# EAGLE design dzik0 (EAGLE 8.4.1)
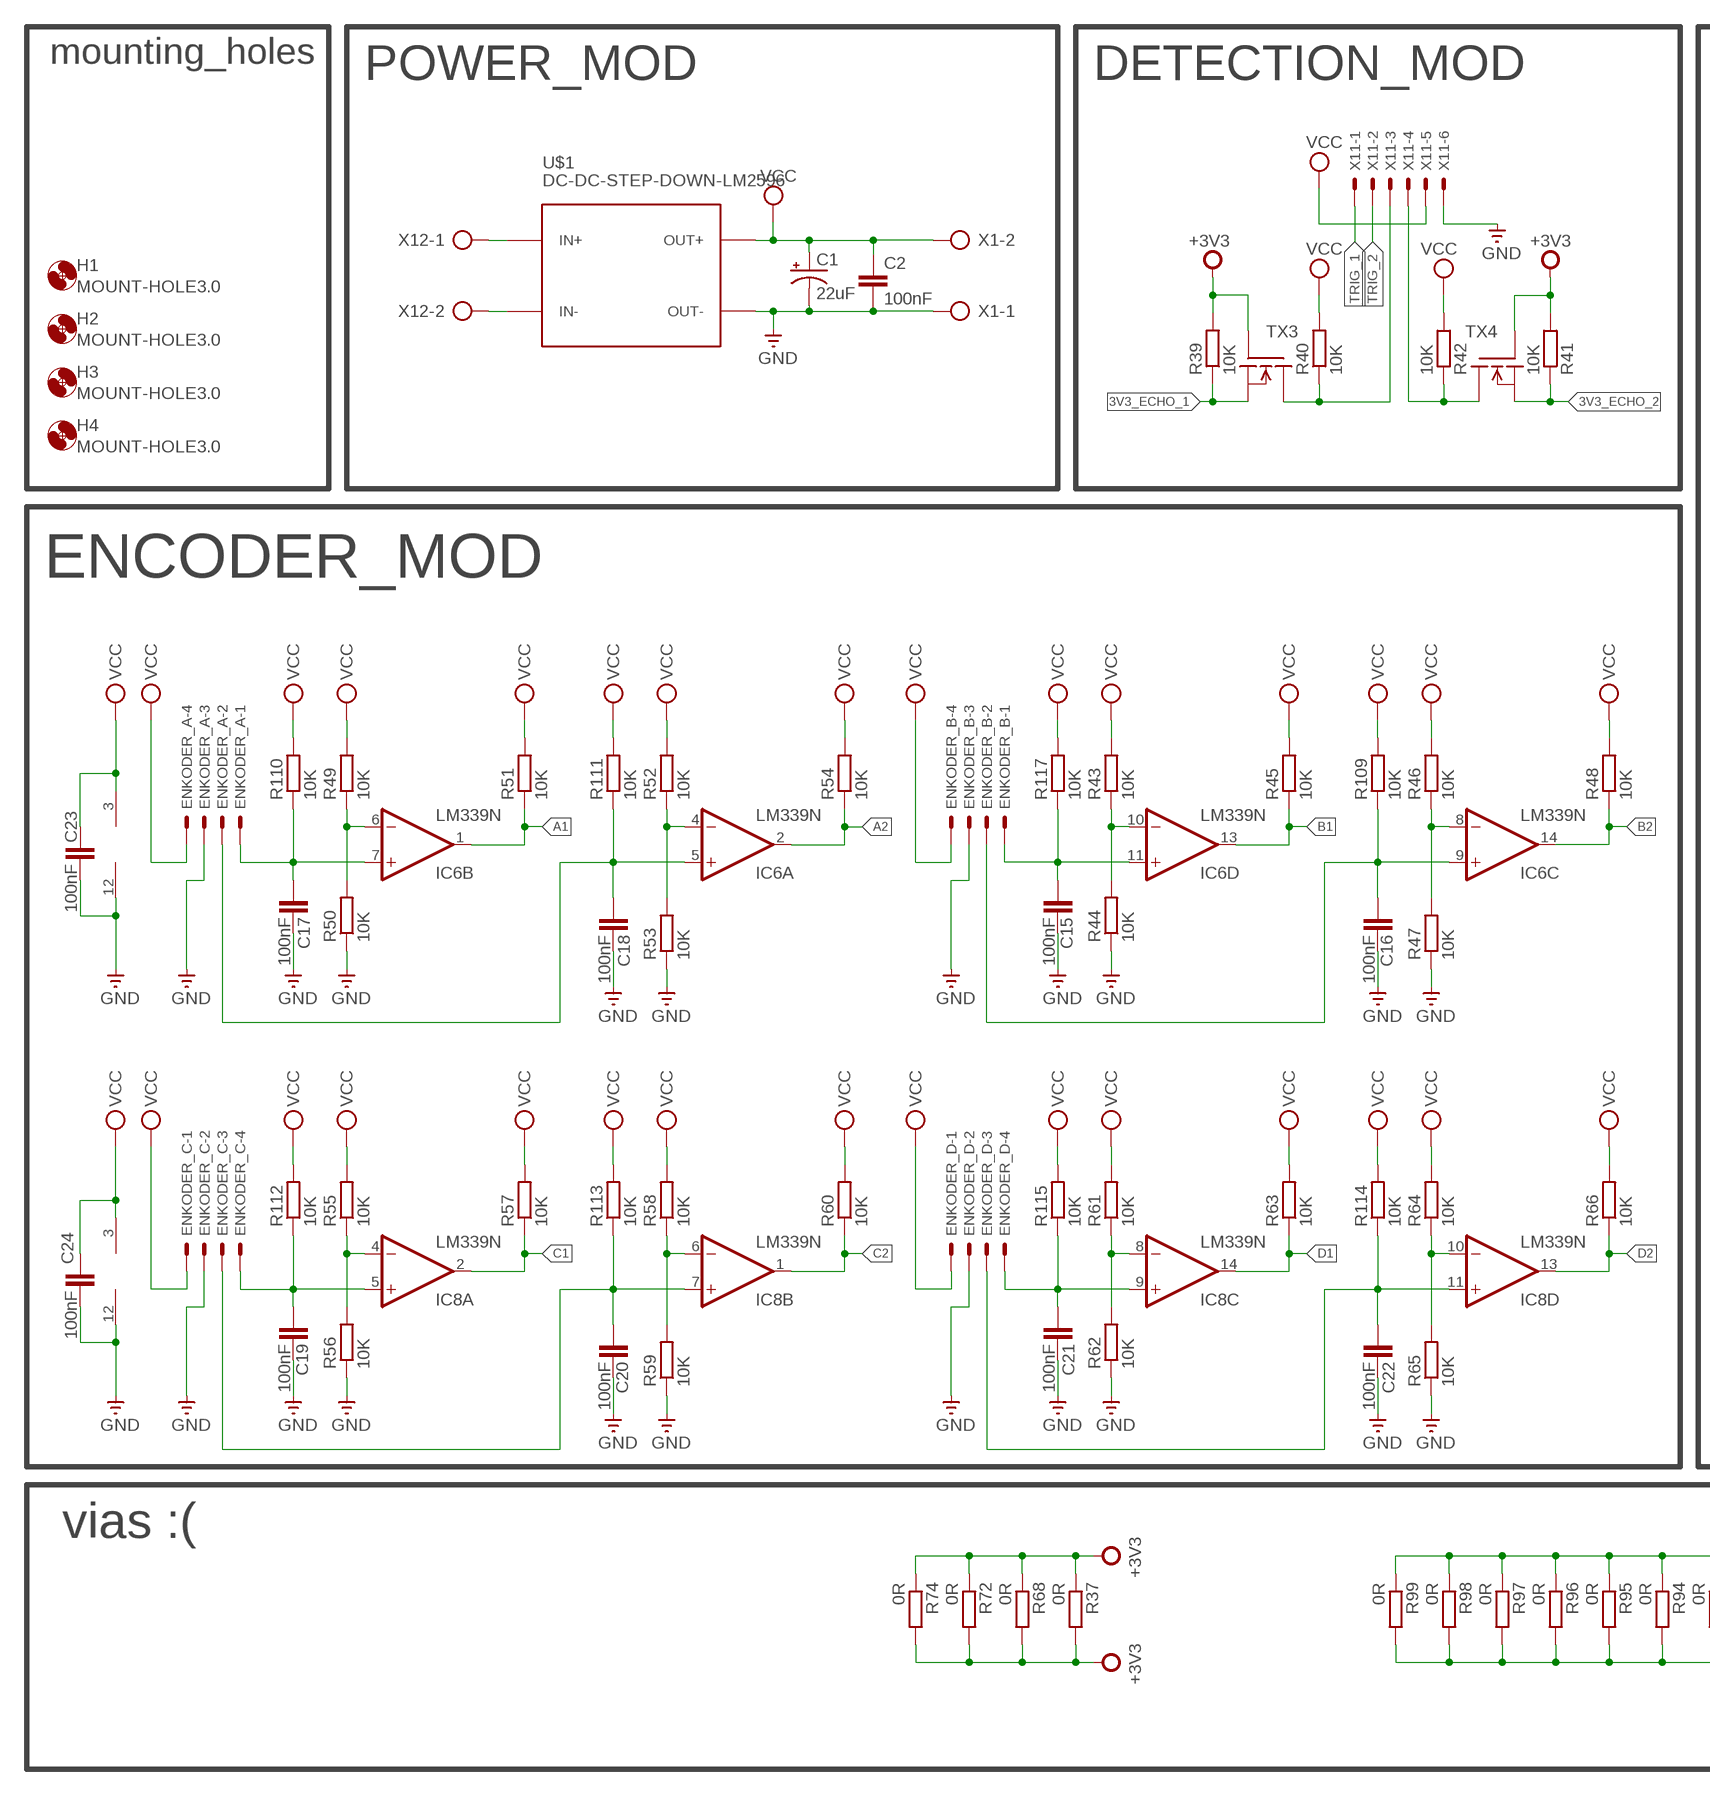
[diagram p0: schematic, sheet 1, part 1 of 2]
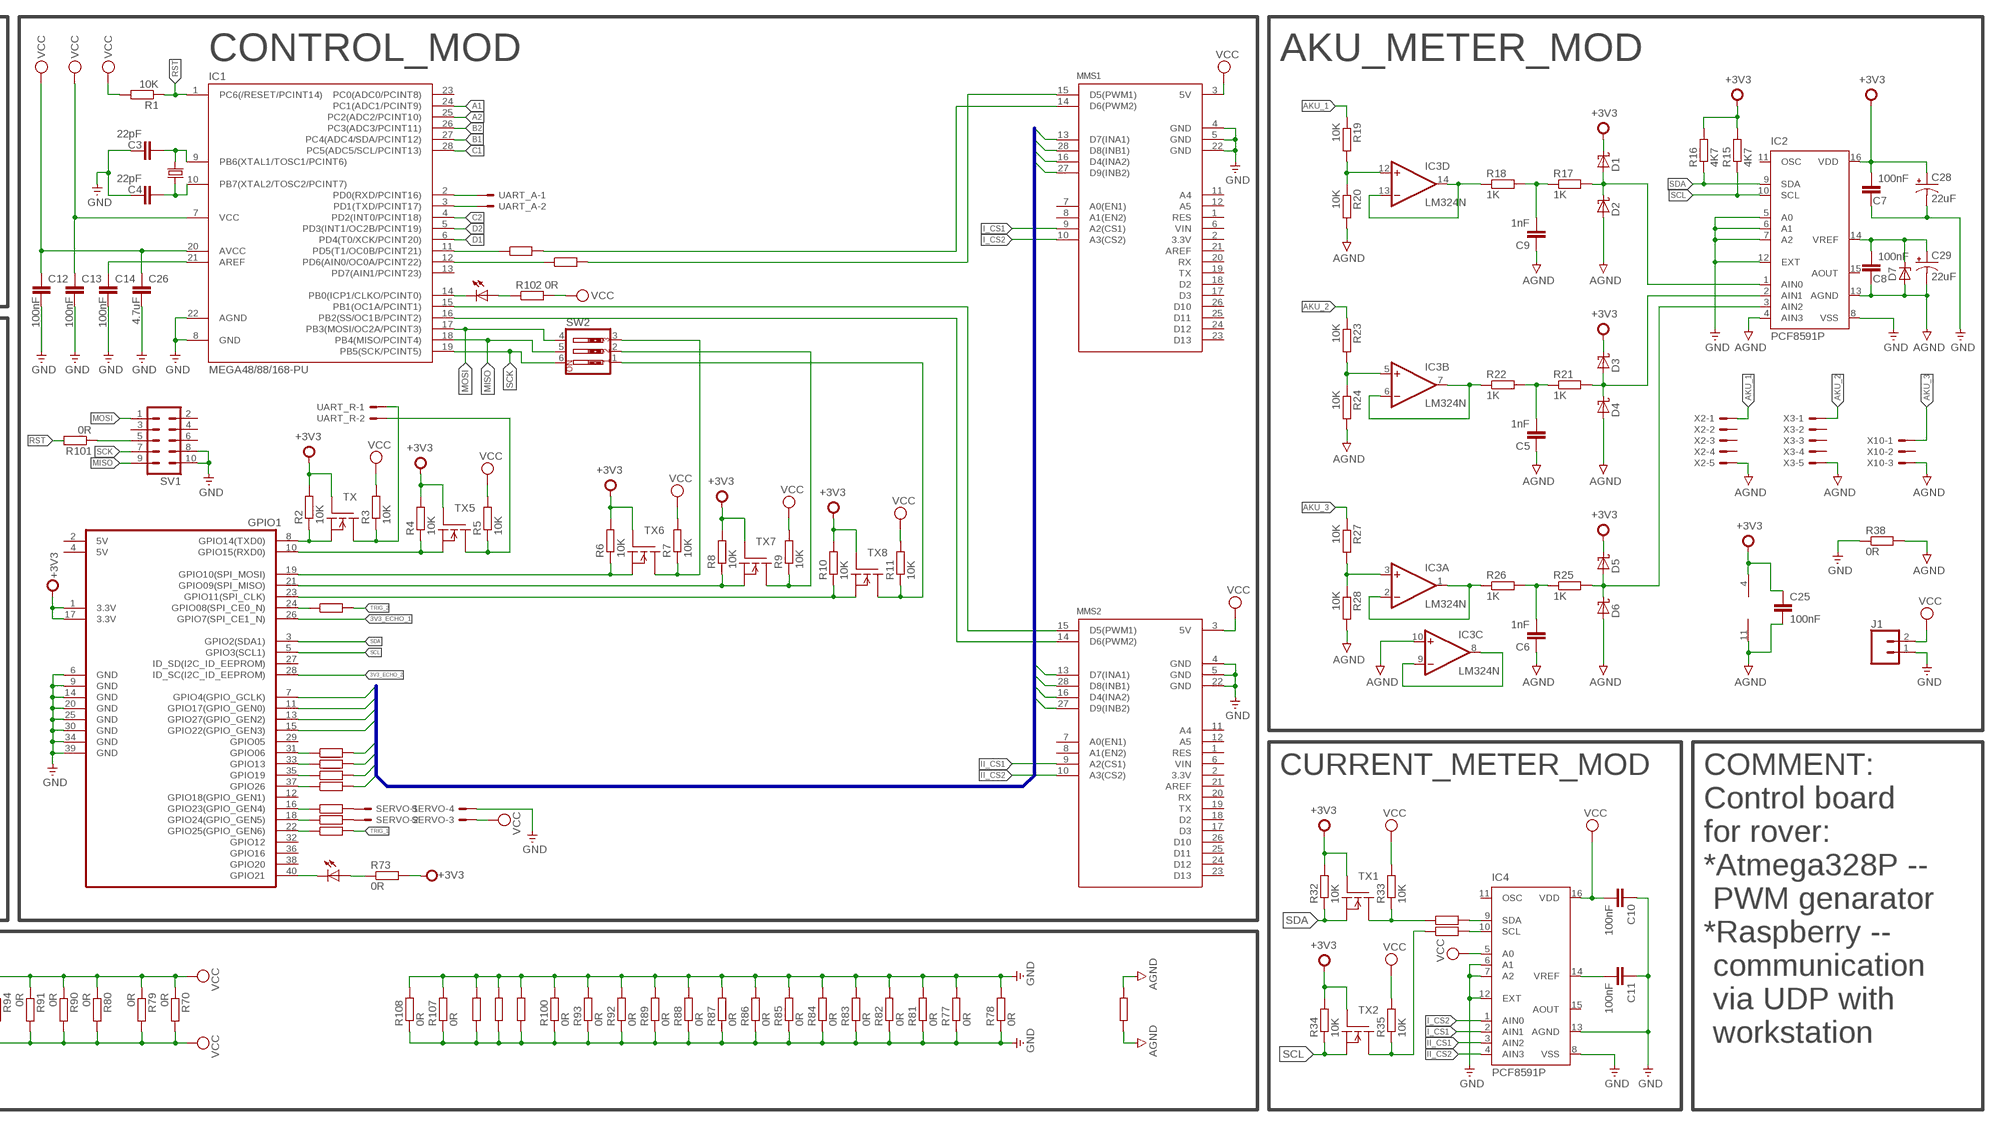
[diagram p1: schematic, sheet 1, part 2 of 2]

## Parts
C1  22uF  CPOL-USE2.5-6  [E2,5-6]
C2  100nF  C-EU025-024X044  [C025-024X044]
C3  22pF  C-EU025-024X044  [C025-024X044]
C4  22pF  C-EU025-024X044  [C025-024X044]
C5  1nF  C-EU025-024X044  [C025-024X044]
C6  1nF  C-EU025-024X044  [C025-024X044]
C7  100nF  C-EU025-024X044  [C025-024X044]
C8  100nF  C-EU025-024X044  [C025-024X044]
C9  1nF  C-EU025-024X044  [C025-024X044]
C10  100nF  C-EU025-024X044  [C025-024X044]
C11  100nF  C-EU025-024X044  [C025-024X044]
C12  100nF  C-EU025-024X044  [C025-024X044]
C13  100nF  C-EU025-024X044  [C025-024X044]
C14  100nF  C-EU025-024X044  [C025-024X044]
C15  100nF  C-EU025-024X044  [C025-024X044]
C16  100nF  C-EU025-024X044  [C025-024X044]
C17  100nF  C-EU025-024X044  [C025-024X044]
C18  100nF  C-EU025-024X044  [C025-024X044]
C19  100nF  C-EU025-024X044  [C025-024X044]
C20  100nF  C-EU025-024X044  [C025-024X044]
C21  100nF  C-EU025-024X044  [C025-024X044]
C22  100nF  C-EU025-024X044  [C025-024X044]
C23  100nF  C-EU025-024X044  [C025-024X044]
C24  100nF  C-EU025-024X044  [C025-024X044]
C25  100nF  C-EU025-024X044  [C025-024X044]
C26  4.7uF  C-EU050-025X075  [C050-025X075]
C28  22uF  CPOL-USE2.5-6  [E2,5-6]
C29  22uF  CPOL-USE2.5-6  [E2,5-6]
D1  SCHOTTKY-DIODEDO35-7  [DO35-7]
D2  SCHOTTKY-DIODEDO35-7  [DO35-7]
D3  SCHOTTKY-DIODEDO35-7  [DO35-7]
D4  SCHOTTKY-DIODEDO35-7  [DO35-7]
D5  SCHOTTKY-DIODEDO35-7  [DO35-7]
D6  SCHOTTKY-DIODEDO35-7  [DO35-7]
D7  ZENER-DIODEZD-5  [ZDIO-5]
ENKODER_A  JST-XH-04-PIN-LONG-PAD  [JST-XH-04-PACKAGE-LONG-PAD]
ENKODER_B  JST-XH-04-PIN-LONG-PAD  [JST-XH-04-PACKAGE-LONG-PAD]
ENKODER_C  JST-XH-04-PIN-LONG-PAD  [JST-XH-04-PACKAGE-LONG-PAD]
ENKODER_D  JST-XH-04-PIN-LONG-PAD  [JST-XH-04-PACKAGE-LONG-PAD]
GPIO1  _GPIO_RASPBERRY  [GPIO_RASPBERRY]
H1  MOUNT-HOLE3.0  [3,0]
H2  MOUNT-HOLE3.0  [3,0]
H3  MOUNT-HOLE3.0  [3,0]
H4  MOUNT-HOLE3.0  [3,0]
IC1  MEGA48/88/168-PU  [DIL28-3]
IC2  PCF8591P  [DIL16]
IC3  LM324N  [DIL14]
IC4  PCF8591P  [DIL16]
IC6  LM339N  [DIL14]
IC8  LM339N  [DIL14]
J1  CONN_02  [1X02]
LED1  LED5MM  [LED5MM]
LED3  LED5MM  [LED5MM]
MMS1  MONSTERMOTO_SHIELD  [MONSTER_MOTO_1]
MMS2  MONSTERMOTO_SHIELD  [MONSTER_MOTO_1]
Q1  11.520MHz  CRYSTALHC49S  [HC49/S]
R1  10K  R-EU_0207/7  [0207/7]
R2  10K  R-EU_0207/7  [0207/7]
R3  10K  R-EU_0207/7  [0207/7]
R4  10K  R-EU_0207/7  [0207/7]
R5  10K  R-EU_0207/7  [0207/7]
R6  10K  R-EU_0207/7  [0207/7]
R7  10K  R-EU_0207/7  [0207/7]
R8  10K  R-EU_0207/7  [0207/7]
R9  10K  R-EU_0207/7  [0207/7]
R10  10K  R-EU_0207/7  [0207/7]
R11  10K  R-EU_0207/7  [0207/7]
R12  0R  R-EU_0207/10  [0207/10]
R13  0R  R-EU_0207/10  [0207/10]
R14  0R  R-EU_0207/10  [0207/10]
R15  4K7  R-EU_0207/7  [0207/7]
R16  4K7  R-EU_0207/7  [0207/7]
R17  1K  R-EU_0207/7  [0207/7]
R18  1K  R-EU_0207/7  [0207/7]
R19  10K  R-EU_0207/7  [0207/7]
R20  10K  R-EU_0207/7  [0207/7]
R21  1K  R-EU_0207/7  [0207/7]
R22  1K  R-EU_0207/7  [0207/7]
R23  10K  R-EU_0207/7  [0207/7]
R24  10K  R-EU_0207/7  [0207/7]
R25  1K  R-EU_0207/7  [0207/7]
R26  1K  R-EU_0207/7  [0207/7]
R27  10K  R-EU_0207/7  [0207/7]
R28  10K  R-EU_0207/7  [0207/7]
R29  0R  R-EU_0204/7  [0204/7]
R30  0R  R-EU_0204/7  [0204/7]
R31  0R  R-EU_0207/7  [0207/7]
R32  10K  R-EU_0207/7  [0207/7]
R33  10K  R-EU_0207/7  [0207/7]
R34  10K  R-EU_0207/7  [0207/7]
R35  10K  R-EU_0207/7  [0207/7]
R36  0R  R-EU_0207/7  [0207/7]
R37  0R  R-EU_0207/7  [0207/7]
R38  0R  R-EU_0207/7  [0207/7]
R39  10K  R-EU_0207/7  [0207/7]
R40  10K  R-EU_0207/7  [0207/7]
R41  10K  R-EU_0207/7  [0207/7]
R42  10K  R-EU_0207/7  [0207/7]
R43  10K  R-EU_0207/7  [0207/7]
R44  10K  R-EU_0207/7  [0207/7]
R45  10K  R-EU_0207/7  [0207/7]
R46  10K  R-EU_0207/7  [0207/7]
R47  10K  R-EU_0207/7  [0207/7]
R48  10K  R-EU_0207/7  [0207/7]
R49  10K  R-EU_0207/7  [0207/7]
R50  10K  R-EU_0207/7  [0207/7]
R51  10K  R-EU_0207/7  [0207/7]
R52  10K  R-EU_0207/7  [0207/7]
R53  10K  R-EU_0207/7  [0207/7]
R54  10K  R-EU_0207/7  [0207/7]
R55  10K  R-EU_0207/7  [0207/7]
R56  10K  R-EU_0207/7  [0207/7]
R57  10K  R-EU_0207/7  [0207/7]
R58  10K  R-EU_0207/7  [0207/7]
R59  10K  R-EU_0207/7  [0207/7]
R60  10K  R-EU_0207/7  [0207/7]
R61  10K  R-EU_0207/7  [0207/7]
R62  10K  R-EU_0207/7  [0207/7]
R63  10K  R-EU_0207/7  [0207/7]
R64  10K  R-EU_0207/7  [0207/7]
R65  10K  R-EU_0207/7  [0207/7]
R66  10K  R-EU_0207/7  [0207/7]
R67  0R  R-EU_0207/10  [0207/10]
R68  0R  R-EU_0207/7  [0207/7]
R69  0R  R-EU_0207/10  [0207/10]
R70  0R  R-EU_0207/10  [0207/10]
R71  0R  R-EU_0207/10  [0207/10]
R72  0R  R-EU_0207/7  [0207/7]
R73  0R  R-EU_0207/7  [0207/7]
R74  0R  R-EU_0207/7  [0207/7]
R75  0R  R-EU_0204/7  [0204/7]
R76  0R  R-EU_0204/7  [0204/7]
R77  0R  R-EU_0207/7  [0207/7]
R78  0R  R-EU_0207/7  [0207/7]
R79  0R  R-EU_0207/7  [0207/7]
R80  0R  R-EU_0207/7  [0207/7]
R81  0R  R-EU_0207/7  [0207/7]
R82  0R  R-EU_0207/7  [0207/7]
R83  0R  R-EU_0207/7  [0207/7]
R84  0R  R-EU_0207/7  [0207/7]
R85  0R  R-EU_0207/7  [0207/7]
R86  0R  R-EU_0207/7  [0207/7]
R87  0R  R-EU_0207/7  [0207/7]
R88  0R  R-EU_0207/7  [0207/7]
R89  0R  R-EU_0207/7  [0207/7]
R90  0R  R-EU_0207/7  [0207/7]
R91  0R  R-EU_0207/7  [0207/7]
R92  0R  R-EU_0207/7  [0207/7]
R93  0R  R-EU_0207/7  [0207/7]
R94  0R  R-EU_0207/7  [0207/7]
R95  0R  R-EU_0207/7  [0207/7]
R96  0R  R-EU_0207/7  [0207/7]
R97  0R  R-EU_0207/7  [0207/7]
R98  0R  R-EU_0207/7  [0207/7]
R99  0R  R-EU_0207/7  [0207/7]
R100  0R  R-EU_0207/7  [0207/7]
R101  0R  R-EU_0207/7  [0207/7]
R102  0R  R-EU_0207/7  [0207/7]
R103  0R  R-EU_0207/10  [0207/10]
R104  0R  R-EU_0207/10  [0207/10]
R105  0R  R-EU_0207/10  [0207/10]
R106  0R  R-EU_0207/7  [0207/7]
R107  0R  R-EU_0207/7  [0207/7]
R108  0R  R-EU_0207/7  [0207/7]
R109  10K  R-EU_0207/7  [0207/7]
R110  10K  R-EU_0207/7  [0207/7]
R111  10K  R-EU_0207/7  [0207/7]
R112  10K  R-EU_0207/7  [0207/7]
R113  10K  R-EU_0207/7  [0207/7]
R114  10K  R-EU_0207/7  [0207/7]
R115  10K  R-EU_0207/7  [0207/7]
R117  10K  R-EU_0207/7  [0207/7]
SERVO  JST-XH-04-PIN-LONG-PAD  [JST-XH-04-PACKAGE-LONG-PAD]
SV1  MA05-2  [MA05-2]
SW2  SW_DIP-3  [EDG-03]
TX  FQN1N50CI  [TO92-INLINE]
TX1  FQN1N50CI  [TO92-INLINE]
TX2  FQN1N50CI  [TO92-INLINE]
TX3  FQN1N50CI  [TO92-INLINE]
TX4  FQN1N50CI  [TO92-INLINE]
TX5  FQN1N50CI  [TO92-INLINE]
TX6  FQN1N50CI  [TO92-INLINE]
TX7  FQN1N50CI  [TO92-INLINE]
TX8  FQN1N50CI  [TO92-INLINE]
U$1  DC-DC-STEP-DOWN-LM2596  [DC-DC-STEP-DOWN-LM2596]
UART_A  JST-XH-02-PIN-LONG-PAD  [JST-XH-02-PACKAGE-LONG-PAD]
UART_R  JST-XH-02-PIN-LONG-PAD  [JST-XH-02-PACKAGE-LONG-PAD]
X1  AK300/2  [AK300/2]
X2  JST-XH-05-PIN-LONG-PAD  [JST-XH-05-PACKAGE-LONG-PAD]
X3  JST-XH-05-PIN-LONG-PAD  [JST-XH-05-PACKAGE-LONG-PAD]
X10  JST-XH-03-PIN-LONG-PAD  [JST-XH-03-PACKAGE-LONG-PAD]
X11  JST-XH-06-PIN-LONG-PAD  [JST-XH-06-PACKAGE-LONG-PAD]
X12  AK300/2  [AK300/2]

## Nets
3V3_ECHO_1: GPIO1.26(GPIO7(SPI_CE1_N)) R39.1 TX3.3(S)
3V3_ECHO_2: GPIO1.28(ID_SC(I2C_ID_EEPROM)) R41.1 TX4.3(S)
3V3_MISO: GPIO1.21(GPIO09(SPI_MISO)) R8.1 TX7.3(S)
3V3_MOSI: GPIO1.19(GPIO10(SPI_MOSI)) R6.1 TX6.3(S)
3V3_SCK: GPIO1.23(GPIO11(SPI_CLK)) R10.1 TX8.3(S)
5V_MISO: R9.1 SW2.2 TX7.1(D)
5V_MOSI: R7.1 SW2.3 TX6.1(D)
5V_SCK: R11.1 SW2.1 TX8.1(D)
+3V3: C7.2 C25.1 C28.+ D1.C D3.C D5.C GPIO1.1(3.3V) GPIO1.17(3.3V) IC2.16(VDD) IC3.4(P:V+) R2.2 R4.2 R6.2 R8.2 R10.2 R15.2 R16.2 R32.2 R34.2 R37.1 R37.2 R39.2 R41.2 R68.1 R68.2 R72.1 R72.2 R73.2 R74.1 R74.2 TX1.2(G) TX2.2(G) TX3.2(G) TX4.2(G) TX5.2(G) TX6.2(G) TX7.2(G) TX8.2(G) TX.2(G)
A1: IC1.24(PC1(ADC1/PCINT9)) IC6.1(B:OUT) R51.1
A2: IC1.25(PC2(ADC2/PCINT10)) IC6.2(A:OUT) R54.1
AGND: C5.1 C6.1 C8.1 C9.1 C25.2 C29.- D2.A D4.A D6.A D7.A IC2.4(AIN3) IC2.13(AGND) IC3.10(C:+IN) IC3.11(P:V-) R20.2 R24.2 R28.2 R38.2 R106.1 R106.2 X2.5 X3.5 X10.3
AKU_1: R19.1 X2.1
AKU_2: R23.1 X3.1
AKU_3: R27.1 X10.1
B1: IC1.27(PC4(ADC4/SDA/PCINT12)) IC6.13(D:OUT) R45.1
B2: IC1.26(PC3(ADC3/PCINT11)) IC6.14(C:OUT) R48.1
C1: IC1.28(PC5(ADC5/SCL/PCINT13)) IC8.2(A:OUT) R57.1
C2: IC1.4(PD2(INT0/PCINT18)) IC8.1(B:OUT) R60.1
D1: IC1.6(PD4(T0/XCK/PCINT20)) IC8.14(C:OUT) R63.1
D2: IC1.5(PD3(INT1/OC2B/PCINT19)) IC8.13(D:OUT) R66.1
E1_0: GPIO1.31(GPIO06) R14.1
E1_1: GPIO1.33(GPIO13) R67.1
E1_2: GPIO1.35(GPIO19) R69.1
E1_3: GPIO1.37(GPIO26) R71.1
ECHO_1: R40.1 TX3.1(D) X11.3
ECHO_2: R42.1 TX4.1(D) X11.4
GND: C1.- C2.2 C3.1 C4.1 C7.1 C10.1 C11.1 C12.2 C13.2 C14.2 C15.2 C16.2 C17.2 C18.2 C19.2 C20.2 C21.2 C22.2 C23.2 C24.2 C26.2 C28.- ENKODER_A.3 ENKODER_B.3 ENKODER_C.2 ENKODER_D.2 GPIO1.6(GND) GPIO1.9(GND) GPIO1.14(GND) GPIO1.20(GND) GPIO1.25(GND) GPIO1.30(GND) GPIO1.34(GND) GPIO1.39(GND) IC1.8(GND) IC1.22(AGND) IC2.5(A0) IC2.6(A1) IC2.7(A2) IC2.8(VSS) IC2.12(EXT) IC4.6(A1) IC4.7(A2) IC4.8(VSS) IC4.12(EXT) IC4.13(AGND) IC6.12(P:GND) IC8.12(P:GND) J1.1 MMS1.4(GND) MMS1.5(GND) MMS1.22(GND) MMS2.4(GND) MMS2.5(GND) MMS2.22(GND) R38.1 R44.1 R47.1 R50.1 R53.1 R56.1 R59.1 R62.1 R65.1 R77.1 R77.2 R78.1 R78.2 R81.1 R81.2 R82.1 R82.2 R83.1 R83.2 R84.1 R84.2 R85.1 R85.2 R86.1 R86.2 R87.1 R87.2 R88.1 R88.2 R89.1 R89.2 R92.1 R92.2 R93.1 R93.2 R100.1 R100.2 R103.1 R103.2 R104.1 R104.2 R105.1 R105.2 R107.1 R107.2 R108.1 R108.2 SERVO.4 SV1.8 SV1.10 U$1.OUT- X1.1 X11.6
I_CS1: IC4.2(AIN1) MMS1.9(A2(CS1))
I_CS2: IC4.1(AIN0) MMS1.10(A3(CS2))
I_D4: MMS1.16(D4(INA2)) R14.2
I_D7: MMS1.13(D7(INA1)) R67.2
I_D8: MMS1.28(D8(INB1)) R69.2
I_D9: MMS1.27(D9(INB2)) R71.2
II_CS1: IC4.3(AIN2) MMS2.9(A2(CS1))
II_CS2: IC4.4(AIN3) MMS2.10(A3(CS2))
II_D4: GPIO1.15(GPIO22(GPIO_GEN3)) MMS2.16(D4(INA2))
II_D7: GPIO1.13(GPIO27(GPIO_GEN2)) MMS2.13(D7(INA1))
II_D8: GPIO1.11(GPIO17(GPIO_GEN0)) MMS2.28(D8(INB1))
II_D9: GPIO1.7(GPIO4(GPIO_GCLK)) MMS2.27(D9(INB2))
MISO: IC1.18(PB4(MISO/PCINT4)) SV1.9 SW2.5
MOSI: IC1.17(PB3(MOSI/OC2A/PCINT3)) SV1.1 SW2.4
MOSI1: R33.1 R36.1 TX1.1(D)
MOSI2: R5.1 TX5.1(D) UART_R.2
MOSI3: R3.1 TX.1(D) UART_R.1
MOSI4: R31.1 R35.1 TX2.1(D)
N$1: C15.1 ENKODER_B.1 IC6.11(D:+IN) R117.1
N$2: C4.2 IC1.10(PB7(XTAL2/TOSC2/PCINT7)) Q1.1
N$3: MMS1.15(D5(PWM1)) R13.2
N$4: MMS1.14(D6(PWM2)) R12.2
N$5: GPIO1.24(GPIO08(SPI_CE0_N)) R29.1
N$6: GPIO1.22(GPIO25(GPIO_GEN6)) R30.1
N$7: C16.1 ENKODER_B.2 IC6.9(C:+IN) R109.1
N$8: IC6.10(D:-IN) R43.1 R44.2
N$9: IC4.9(SDA) R36.2
N$10: IC6.8(C:-IN) R46.1 R47.2
N$11: IC3.8(C:OUT) IC3.9(C:-IN)
N$12: C17.1 ENKODER_A.1 IC6.7(B:+IN) R110.1
N$13: C19.1 ENKODER_C.4 IC8.5(A:+IN) R112.1
N$14: IC8.4(A:-IN) R55.1 R56.2
N$15: GPIO1.10(GPIO15(RXD0)) R4.1 TX5.3(S)
N$16: GPIO1.8(GPIO14(TXD0)) R2.1 TX.3(S)
N$17: C8.2 C29.+ D7.C IC2.14(VREF)
N$18: C14.1 IC1.21(AREF)
N$19: GPIO1.40(GPIO21) LED3.K(C)
N$20: IC4.10(SCL) R31.2
N$21: U$1.IN+ X12.1
N$22: IC1.3(PD1(TXD/PCINT17)) UART_A.2
N$23: U$1.IN- X12.2
N$24: IC6.6(B:-IN) R49.1 R50.2
N$25: IC6.4(A:-IN) R52.1 R53.2
N$26: GPIO1.18(GPIO24(GPIO_GEN5)) R75.1
N$27: C18.1 ENKODER_A.2 IC6.5(A:+IN) R111.1
N$28: GPIO1.16(GPIO23(GPIO_GEN4)) R76.1
N$29: IC1.2(PD0(RXD/PCINT16)) UART_A.1
N$30: IC8.6(B:-IN) R58.1 R59.2
N$31: IC3.5(B:+IN) R23.2 R24.1
N$32: R75.2 SERVO.2
N$33: IC3.3(A:+IN) R27.2 R28.1
N$34: IC3.12(D:+IN) R19.2 R20.1
N$35: C3.2 IC1.9(PB6(XTAL1/TOSC1/PCINT6)) Q1.2
N$36: R76.2 SERVO.1
N$37: LED1.A R102.1
N$38: IC1.14(PB0(ICP1/CLKO/PCINT0)) LED1.K(C)
N$39: R101.1 SV1.5
N$40: D1.A D2.C IC2.1(AIN0) R17.2
N$41: C9.2 R17.1 R18.2
N$43: D3.A D4.C IC2.2(AIN1) R21.2
N$45: D5.A D6.C IC2.3(AIN2) R25.2
N$47: C5.2 R21.1 R22.2
N$51: C11.2 IC4.14(VREF)
N$52: C6.2 R25.1 R26.2
N$58: LED3.A R73.1
N$60: IC3.13(D:-IN) IC3.14(D:OUT) R18.1
N$62: C20.1 ENKODER_C.3 IC8.7(B:+IN) R113.1
N$65: IC3.6(B:-IN) IC3.7(B:OUT) R22.1
N$66: C21.1 ENKODER_D.4 IC8.9(C:+IN) R115.1
N$67: IC8.8(C:-IN) R61.1 R62.2
N$68: IC8.10(D:-IN) R64.1 R65.2
N$69: IC3.1(A:OUT) IC3.2(A:-IN) R26.1
N$70: C22.1 ENKODER_D.3 IC8.11(D:+IN) R114.1
PWM1: IC1.12(PD6(AIN0/OC0A/PCINT22)) R13.1
PWM2: IC1.11(PD5(T1/OC0B/PCINT21)) R12.1
PWM3: IC1.15(PB1(OC1A/PCINT1)) MMS2.15(D5(PWM1))
PWM4: IC1.16(PB2(SS/OC1B/PCINT2)) MMS2.14(D6(PWM2))
RST: IC1.1(PC6(/RESET/PCINT14)) R1.1 R101.2
SCK: IC1.19(PB5(SCK/PCINT5)) SV1.7 SW2.6
SCL: GPIO1.5(GPIO3(SCL1)) IC2.10(SCL) R15.1 R34.1 TX2.3(S)
SDA: GPIO1.3(GPIO2(SDA1)) IC2.9(SDA) R16.1 R32.1 TX1.3(S)
TRIG_1: R30.2 X11.1
TRIG_2: R29.2 X11.2
VCC: C1.+ C2.1 C10.2 C12.1 C13.1 C23.1 C24.1 C26.1 ENKODER_A.4 ENKODER_B.4 ENKODER_C.1 ENKODER_D.1 IC1.7(VCC) IC1.20(AVCC) IC4.5(A0) IC4.16(VDD) IC6.3(P:V+) IC8.3(P:V+) J1.2 MMS1.3(5V) MMS2.3(5V) R1.2 R3.2 R5.2 R7.2 R9.2 R11.2 R33.2 R35.2 R40.2 R42.2 R43.2 R45.2 R46.2 R48.2 R49.2 R51.2 R52.2 R54.2 R55.2 R57.2 R58.2 R60.2 R61.2 R63.2 R64.2 R66.2 R70.1 R70.2 R79.1 R79.2 R80.1 R80.2 R90.1 R90.2 R91.1 R91.2 R94.1 R94.2 R95.1 R95.2 R96.1 R96.2 R97.1 R97.2 R98.1 R98.2 R99.1 R99.2 R102.2 R109.2 R110.2 R111.2 R112.2 R113.2 R114.2 R115.2 R117.2 SERVO.3 U$1.OUT+ X1.2 X11.5
Unconnected: GPIO1.2(5V) GPIO1.4(5V) GPIO1.12(GPIO18(GPIO_GEN1)) GPIO1.27(ID_SD(I2C_ID_EEPROM)) GPIO1.29(GPIO05) GPIO1.32(GPIO12) GPIO1.36(GPIO16) GPIO1.38(GPIO20) IC1.13(PD7(AIN1/PCINT23)) IC1.23(PC0(ADC0/PCINT8)) IC2.11(OSC) IC2.15(AOUT) IC4.11(OSC) IC4.15(AOUT) MMS1.1(RES) MMS1.2(3.3V) MMS1.6(VIN) MMS1.7(A0(EN1)) MMS1.8(A1(EN2)) MMS1.11(A4) MMS1.12(A5) MMS1.17(D3) MMS1.18(D2) MMS1.19(TX) MMS1.20(RX) MMS1.21(AREF) MMS1.23(D13) MMS1.24(D12) MMS1.25(D11) MMS1.26(D10) MMS2.1(RES) MMS2.2(3.3V) MMS2.6(VIN) MMS2.7(A0(EN1)) MMS2.8(A1(EN2)) MMS2.11(A4) MMS2.12(A5) MMS2.17(D3) MMS2.18(D2) MMS2.19(TX) MMS2.20(RX) MMS2.21(AREF) MMS2.23(D13) MMS2.24(D12) MMS2.25(D11) MMS2.26(D10) SV1.2 SV1.3 SV1.4 SV1.6 X2.2 X2.3 X2.4 X3.2 X3.3 X3.4 X10.2

## Buses
B$1

## Notes on the sheet
- mounting_holes
- POWER_MOD | DETECTION_MOD
- CONTROL_MOD | AKU_METER_MOD
- ENCODER_MOD
- CURRENT_METER_MOD | COMMENT:
- vias :(
- Control board 
  for rover:
  *Atmega328P --
   PWM genarator
  *Raspberry --
   communication
   via UDP with
   workstation

## Library data of the parts
C1 C28 C29 = rcl:CPOL-US: POLARIZED CAPACITOR, American symbol
C2-C26 = rcl:C-EU: CAPACITOR, European symbol
D1-D6 = adafruit:SCHOTTKY-DIODE: Schottky Diode
D7 = diode:ZENER-DIODE: Z-Diode
ENKODER_A ENKODER_B ENKODER_C ENKODER_D SERVO = Rembrandt Electronics - JST XH Connectors v1-0:JST-XH-04-PIN: JST XH Connector 2 Pin Wire to board connector. Pitch: 2,54 mm, (0.100") Number of pins: 4 Created by Rembrandt Electronics www.rembrandtelectronics.com
GPIO1 = _GPIO_raspberry:_GPIO_RASPBERRY
H1-H4 = holes:MOUNT-HOLE: MOUNTING HOLE with drill center marker
IC1 = atmega-atxmega:MEGA48/88/168-PU
IC2 IC4 = micro-philips:PCF8591: I2C-Bus D/A CONVERTER; MF: FARNELL; MPN: PCF8591P; OC_FARNELL: 396412; OC_NEWARK: 07WX3385
IC3 = linear:LM324: OP AMP
IC6 IC8 = linear:LM339: Low Power Low Offset Voltage Quad Comparators with open collector; LM139/LM239/LM339/LM2901/LM3302
J1 = sparkfun_connectors:CONN_02: Multi connection point. Often used as Generic Header-pin footprint for 0.1 inch spaced/style header connections On any of the 0.1 inch spaced packages, you can populate with these: Break Away Headers - Straight <https://www.sparkfun.com/products/116> (PRT-00116) Break Away Male Headers - Right Angle <https://www.sparkfun.com/products/553> (PRT-00553) Female Headers <https://www.sparkfun.com/products/115> (PRT-00115) Break Away Headers - Machine Pin <https://www.sparkfun.com/products/117> (PRT-00117) Break Away Female Headers - Swiss Machine Pin <https://www.sparkfun.com/products/743> (PRT-00743) For SCREWTERMINALS and SPRING TERMINALS visit here: Screw Terimnals on SparkFun.com <https://www.sparkfun.com/search/results?term=Screw+Terminals> (5mm/3.5mm/2.54mm spacing) This device is also useful as a general connection point to wire up your design to another part of your project. Our various solder wires solder well into these plated through hole pads. Hook-Up Wire - Assortment (Stranded, 22 AWG) <https://www.sparkfun.com/products/11375> (PRT-11375) Hook-Up Wire - Assortment (Solid Core, 22 AWG) <https://www.sparkfun.com/products/11367> (PRT-11367) View the entire wire category on our website here <https://www.sparkfun.com/categories/141> Special notes: Molex polarized connector foot print use with: PRT-08233 with associated crimp pins and housings. 2.54_SCREWTERM for use with PRT-10571. 3.5mm Screw Terminal footprints for PRT-08084 5mm Screw Terminal footprints for use with PRT-08432
LED1 LED3 = adafruit:LED: LED OSRAM: - CHIPLED LG R971, LG N971, LY N971, LG Q971, LY Q971, LO R971, LY R971 LH N974, LH R974 LS Q976, LO Q976, LY Q976 LO Q996 - Hyper CHIPLED LW Q18S LB Q993, LB Q99A, LB R99A - SideLED LS A670, LO A670, LY A670, LG A670, LP A670 LB A673, LV A673, LT A673, LW A673 LH A674 LY A675 LS A676, LA A676, LO A676, LY A676, LW A676 LS A679, LY A679, LG A679 - Hyper Micro SIDELED® LS Y876, LA Y876, LO Y876, LY Y876 LT Y87S - SmartLED LW L88C, LW L88S LB L89C, LB L89S, LG L890 LS L89K, LO L89K, LY L89K LS L896, LA L896, LO L896, LY L896 - TOPLED LS T670, LO T670, LY T670, LG T670, LP T670 LSG T670, LSP T670, LSY T670, LOP T670, LYG T670 LG T671, LOG T671, LSG T671 LB T673, LV T673, LT T673, LW T673 LH T674 LS T676, LA T676, LO T676, LY T676, LB T676, LH T676, LSB T676, LW T676 LB T67C, LV T67C, LT T67C, LS T67K, LO T67K, LY T67K, LW E67C LS E67B, LA E67B, LO E67B, LY E67B, LB E67C, LV E67C, LT E67C LW T67C LS T679, LY T679, LG T679 LS T770, LO T770, LY T770, LG T770, LP T770 LB T773, LV T773, LT T773, LW T773 LH T774 LS E675, LA E675, LY E675, LS T675 LS T776, LA T776, LO T776, LY T776, LB T776 LHGB T686 LT T68C, LB T68C - Hyper Mini TOPLED® LB M676 - Mini TOPLED Santana® LG M470 LS M47K, LO M47K, LY M47K Source: http://www.osram.convergy.de/
MMS1 MMS2 = _monster_moto_shield:MONSTERMOTO_SHIELD
Q1 = crystal:CRYSTAL: CRYSTAL; OC_FARNELL: 1667008; OC_NEWARK: unknown
R1-R115 R117 = rcl:R-EU_: RESISTOR, European symbol
SV1 = con-lstb:MA05-2: PIN HEADER; OC_FARNELL: unknown; OC_NEWARK: unknown
SW2 = special:SW_DIP-3: DIP SWITCH
TX TX1-TX8 = adafruit:FQN1N50C: N-Channel Enhancement MOSFET 500V, 0.4A, 6.0 Ohm
U$1 = diy-modules:DC-DC-STEP-DOWN-LM2596: DC/DC Step-Down Regulator based on LM2596-ADJ chip LM2596 datasheet available here: http://www.ti.com/lit/ds/symlink/lm2596.pdf Click here to find device on ebay.com <http://www.ebay.com/sch/lm2596+power+regulator>
UART_A UART_R = Rembrandt Electronics - JST XH Connectors v1-0:JST-XH-02-PIN: JST XH Connector 2 Pin Wire to board connector. Pitch: 2,54 mm, (0.100") Number of pins: 2 Created by Rembrandt Electronics www.rembrandtelectronics.com
X1 X12 = con-ptr500:AK300/2: CONNECTOR; OC_FARNELL: unknown; OC_NEWARK: unknown
X2 X3 = Rembrandt Electronics - JST XH Connectors v1-0:JST-XH-05-PIN: JST XH Connector 2 Pin Wire to board connector. Pitch: 2,54 mm, (0.100") Number of pins: 5 Created by Rembrandt Electronics www.rembrandtelectronics.com
X10 = Rembrandt Electronics - JST XH Connectors v1-0:JST-XH-03-PIN: JST XH Connector 2 Pin Wire to board connector. Pitch: 2,54 mm, (0.100") Number of pins: 3 Created by Rembrandt Electronics www.rembrandtelectronics.com
X11 = Rembrandt Electronics - JST XH Connectors v1-0:JST-XH-06-PIN: JST XH Connector 2 Pin Wire to board connector. Pitch: 2,54 mm, (0.100") Number of pins: 6 Created by Rembrandt Electronics www.rembrandtelectronics.com

## Board
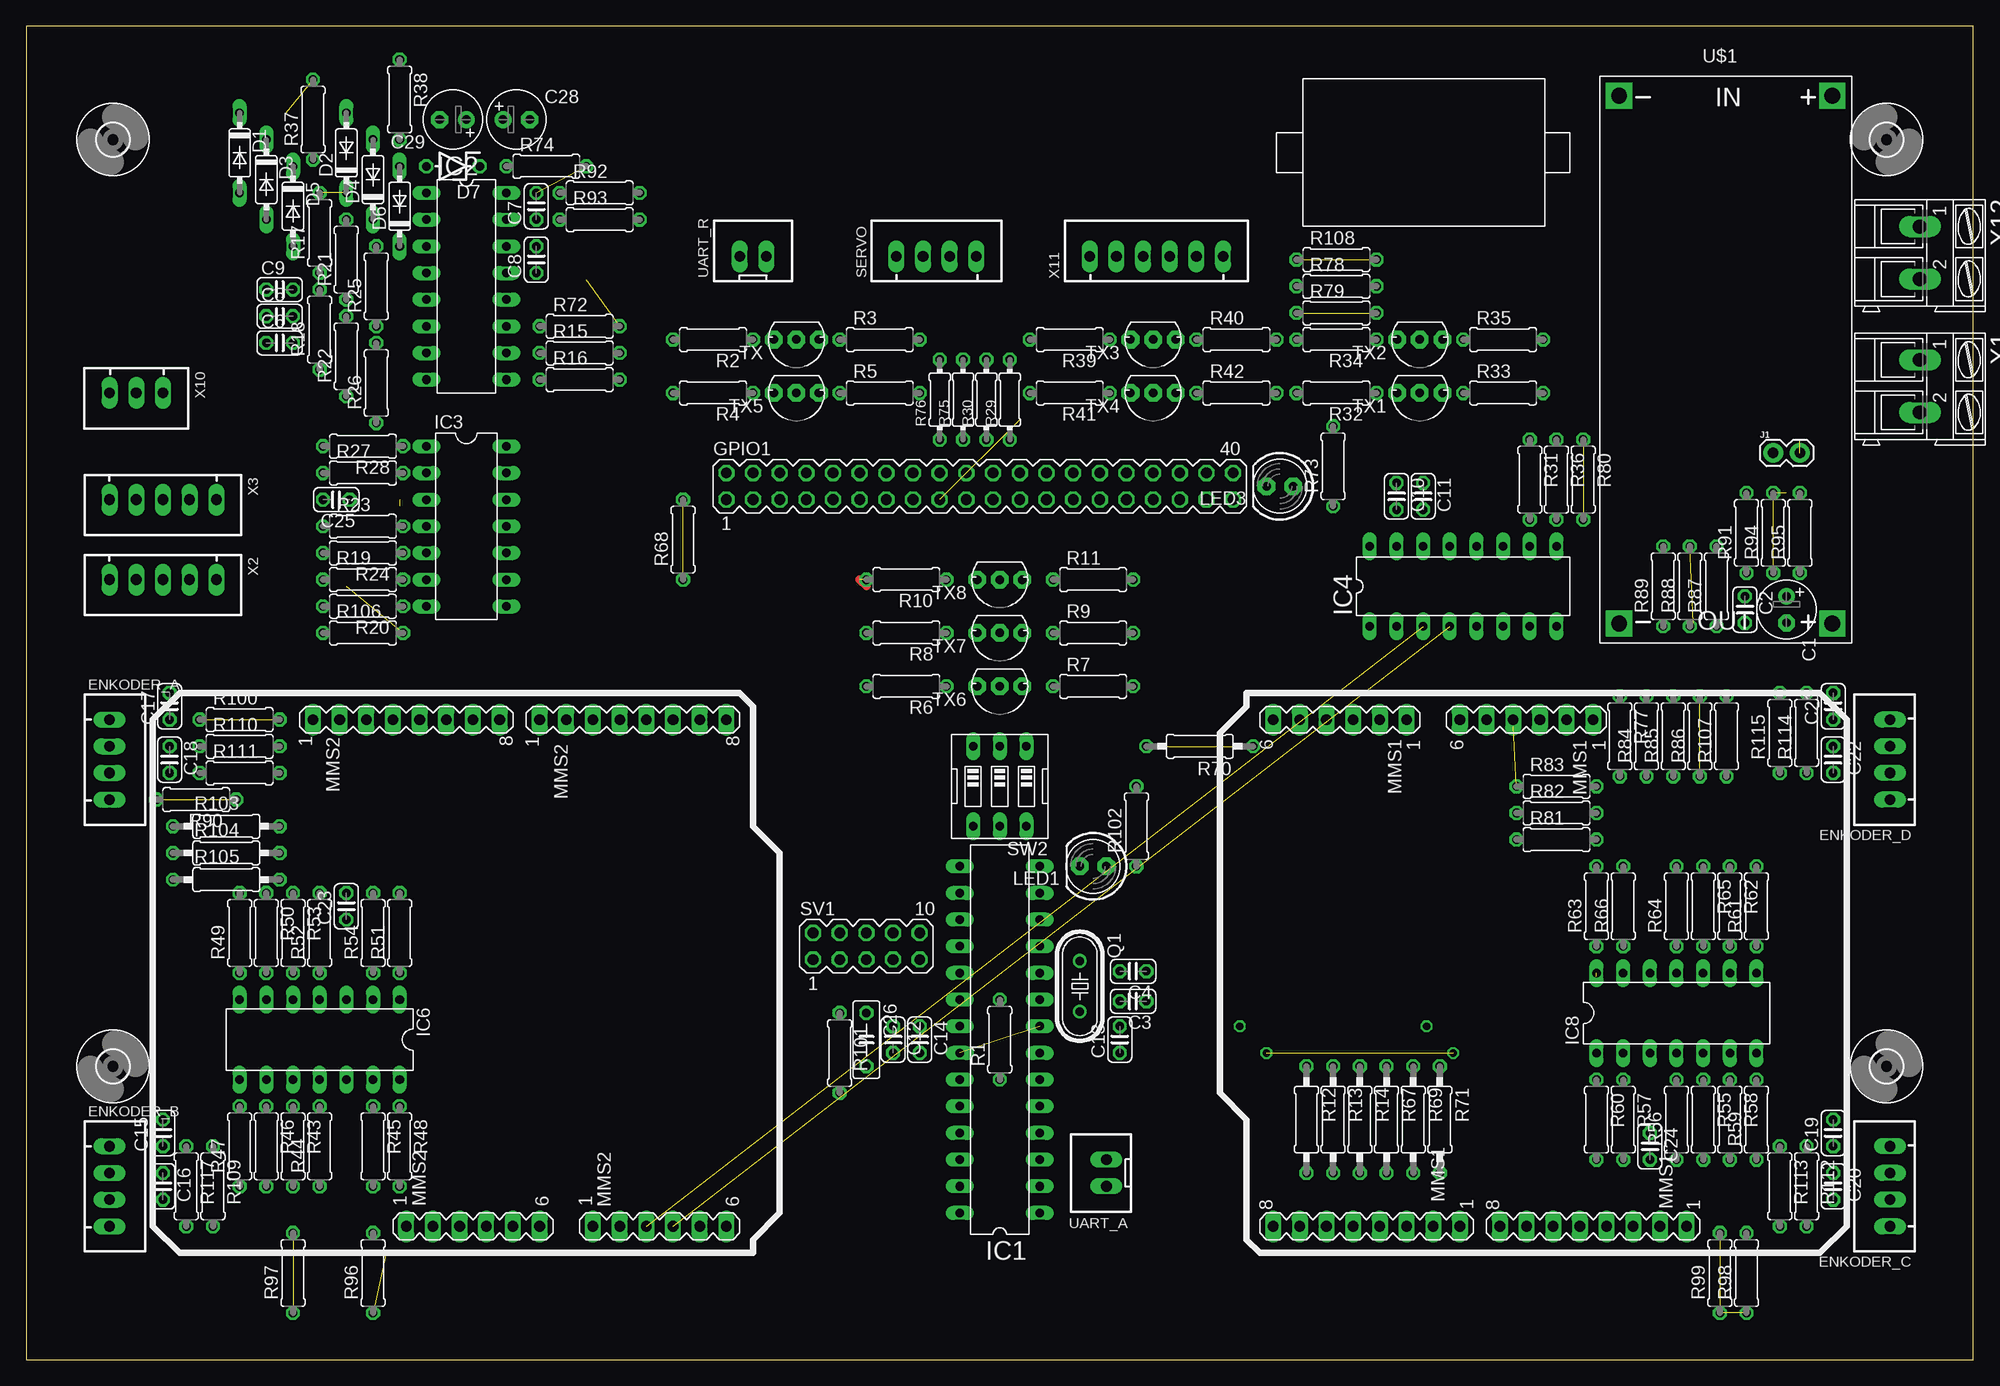
[diagram p2: board, top side]
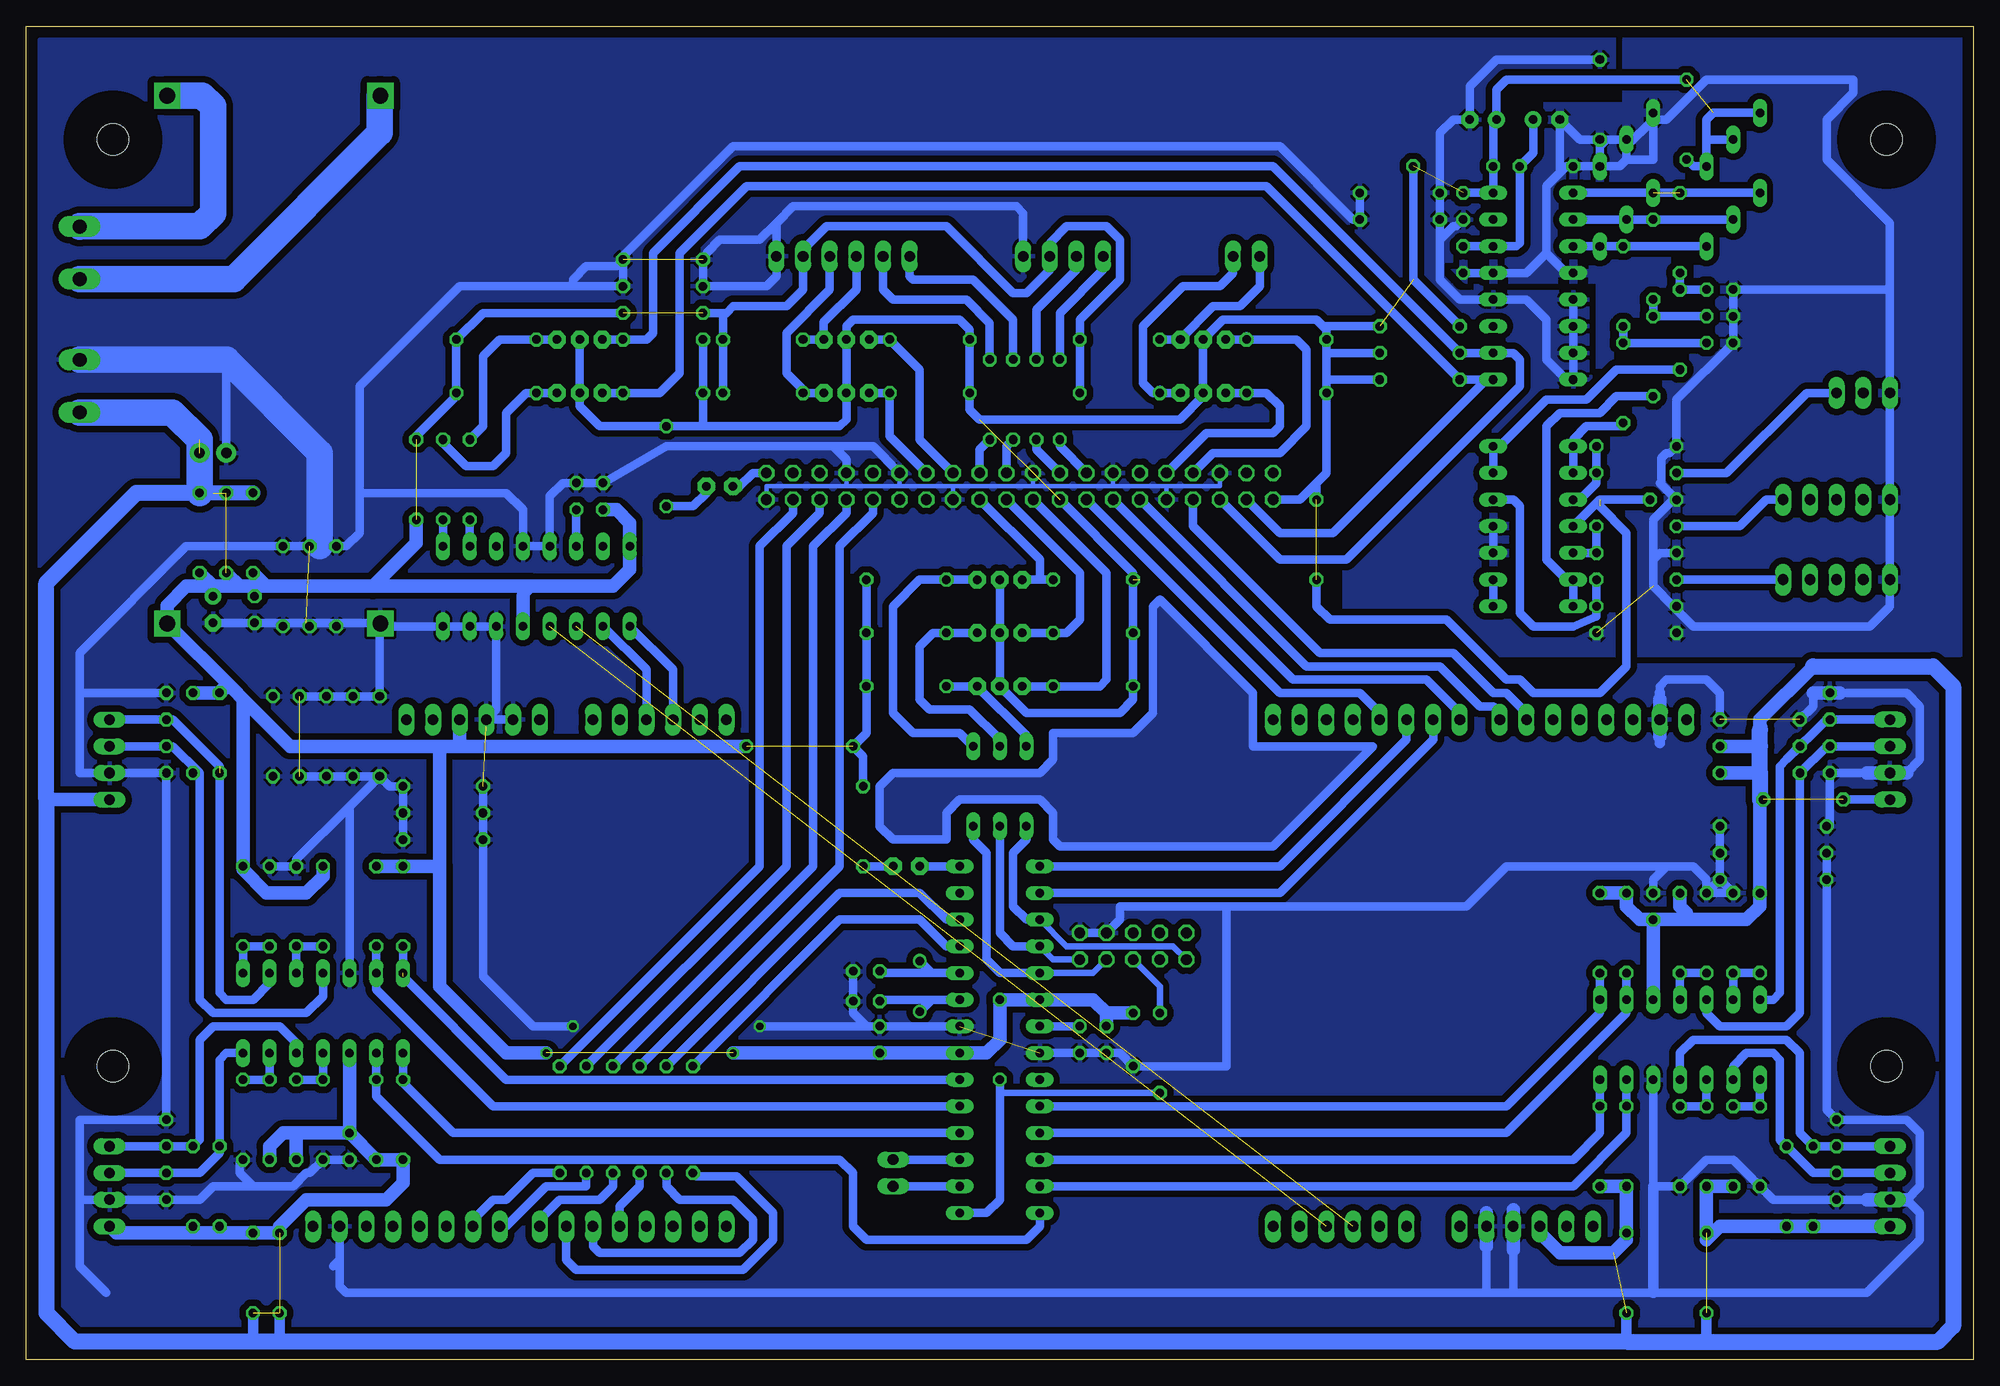
[diagram p3: board, bottom side, seen from below]

Size 185.42 x 127 mm. Coordinates in mm from the lower left corner, seen from the top.
Outline: 0,0 185.42,0 185.42,127 0,127 0,0
Copper layers (1*16): Top 0.035mm / dielectric 1.5mm / Bottom 0.035mm
Design rules "default": minimum track width 10mil, minimum drill 24mil, track to track 8mil, track to pad 8mil, pad to pad 8mil, via to via 8mil, smd to smd 8mil, copper to edge 40mil, drill to drill 8mil, minimum pad ring 10mil, minimum via ring 8mil, stop-mask expansion 4mil, vias tented up to drill 0mil, thermal gap 10mil

### Footprints (pad centres in the part's own frame; a part is rotated, then mirrored left to right if it is on the bottom)
E2,5-6 = drill 0.813 pad 1.6: + -1.27,0 | drill 0.813 pad 1.6 octagon: - 1.27,0
C025-024X044 = drill 0.813 octagon: 1 -1.27,0; 2 1.27,0
C050-025X075 = drill 0.813 octagon: 1 -2.54,0; 2 2.54,0
DO35-7 = drill 0.813 long: A 3.81,0; C -3.81,0
ZDIO-5 = drill 0.813 octagon: A 2.54,0; C -2.54,0
JST-XH-04-PACKAGE-LONG-PAD = drill 1.016 long: 1 -3.81,0; 2 -1.27,0; 3 1.27,0; 4 3.81,0
GPIO_RASPBERRY = drill 1.016 octagon: 1 -3.81,-1.27; 2 -1.27,-1.27; 3 -3.81,-3.81; 4 -1.27,-3.81; 5 -3.81,-6.35; 6 -1.27,-6.35; 7 -3.81,-8.89; 8 -1.27,-8.89; 9 -3.81,-11.43; 10 -1.27,-11.43; 11 -3.81,-13.97; 12 -1.27,-13.97; 13 -3.81,-16.51; 14 -1.27,-16.51; 15 -3.81,-19.05; 16 -1.27,-19.05; 17 -3.81,-21.59; 18 -1.27,-21.59; 19 -3.81,-24.13; 20 -1.27,-24.13; 21 -3.81,-26.67; 22 -1.27,-26.67; 23 -3.81,-29.21; 24 -1.27,-29.21; 25 -3.81,-31.75; 26 -1.27,-31.75; 27 -3.81,-34.29; 28 -1.27,-34.29; 29 -3.81,-36.83; 30 -1.27,-36.83; 31 -3.81,-39.37; 32 -1.27,-39.37; 33 -3.81,-41.91; 34 -1.27,-41.91; 35 -3.81,-44.45; 36 -1.27,-44.45; 37 -3.81,-46.99; 38 -1.27,-46.99; 39 -3.81,-49.53; 40 -1.27,-49.53
3,0 = hole 3: 0,0
DIL28-3 = drill 0.813 long: 1 -16.51,-3.81; 2 -13.97,-3.81; 3 -11.43,-3.81; 4 -8.89,-3.81; 5 -6.35,-3.81; 6 -3.81,-3.81; 7 -1.27,-3.81; 8 1.27,-3.81; 9 3.81,-3.81; 10 6.35,-3.81; 11 8.89,-3.81; 12 11.43,-3.81; 13 13.97,-3.81; 14 16.51,-3.81; 15 16.51,3.81; 16 13.97,3.81; 17 11.43,3.81; 18 8.89,3.81; 19 6.35,3.81; 20 3.81,3.81; 21 1.27,3.81; 22 -1.27,3.81; 23 -3.81,3.81; 24 -6.35,3.81; 25 -8.89,3.81; 26 -11.43,3.81; 27 -13.97,3.81; 28 -16.51,3.81
DIL16 = drill 0.813 long: 1 -8.89,-3.81; 2 -6.35,-3.81; 3 -3.81,-3.81; 4 -1.27,-3.81; 5 1.27,-3.81; 6 3.81,-3.81; 7 6.35,-3.81; 8 8.89,-3.81; 9 8.89,3.81; 10 6.35,3.81; 11 3.81,3.81; 12 1.27,3.81; 13 -1.27,3.81; 14 -3.81,3.81; 15 -6.35,3.81; 16 -8.89,3.81
DIL14 = drill 0.813 long: 1 -7.62,-3.81; 2 -5.08,-3.81; 3 -2.54,-3.81; 4 0,-3.81; 5 2.54,-3.81; 6 5.08,-3.81; 7 7.62,-3.81; 8 7.62,3.81; 9 5.08,3.81; 10 2.54,3.81; 11 0,3.81; 12 -2.54,3.81; 13 -5.08,3.81; 14 -7.62,3.81
1X02 = drill 1.016 pad 1.88: 1 0,0; 2 2.54,0
LED5MM = drill 0.813 pad 1.676 octagon: A -1.27,0; K 1.27,0
MONSTER_MOTO_1 = drill 1.016 long: 1 -24.13,4.445; 2 -24.13,1.905; 3 -24.13,-0.635; 4 -24.13,-3.175; 5 -24.13,-5.715; 6 -24.13,-8.255; 7 -24.13,-13.335; 8 -24.13,-15.875; 9 -24.13,-18.415; 10 -24.13,-20.955; 11 -24.13,-23.495; 12 -24.13,-26.035; 13 24.13,-8.255; 14 24.13,-10.795; 15 24.13,-13.335; 16 24.13,-15.875; 17 24.13,-18.415; 18 24.13,-20.955; 19 24.13,-23.495; 20 24.13,-26.035; 21 24.13,13.335; 22 24.13,10.795; 23 24.13,8.255; 24 24.13,5.715; 25 24.13,3.175; 26 24.13,0.635; 27 24.13,-1.905; 28 24.13,-4.445
HC49/S = drill 0.813: 1 -2.413,0; 2 2.413,0
0207/7 = drill 0.813 octagon: 1 -3.81,0; 2 3.81,0
0207/10 = drill 0.813 octagon: 1 -5.08,0; 2 5.08,0
0204/7 = drill 0.813 octagon: 1 -3.81,0; 2 3.81,0
MA05-2 = drill 1.016 octagon: 1 -5.08,-1.27; 2 -5.08,1.27; 3 -2.54,-1.27; 4 -2.54,1.27; 5 0,-1.27; 6 0,1.27; 7 2.54,-1.27; 8 2.54,1.27; 9 5.08,-1.27; 10 5.08,1.27
EDG-03 = drill 0.813 long: 1 -2.54,-3.81; 2 0,-3.81; 3 2.54,-3.81; 4 2.54,3.81; 5 0,3.81; 6 -2.54,3.81
TO92-INLINE = drill 0.813 pad 1.676 octagon: 1 -2.159,0; 2 0,0; 3 2.159,0
DC-DC-STEP-DOWN-LM2596 = drill 1.5 pad 2.5 square: IN+ 1.857,22.13; IN- 1.857,1.841; OUT+ 52.118,22.13; OUT- 52.118,1.841
JST-XH-02-PACKAGE-LONG-PAD = drill 1.016 long: 1 -1.27,0; 2 1.27,0
AK300/2 = drill 1.321 long: 1 -2.515,0; 2 2.489,0
JST-XH-05-PACKAGE-LONG-PAD = drill 1.016 long: 1 -5.08,0; 2 -2.54,0; 3 0,0; 4 2.54,0; 5 5.08,0
JST-XH-03-PACKAGE-LONG-PAD = drill 1.016 long: 1 -2.54,0; 2 0,0; 3 2.54,0
JST-XH-06-PACKAGE-LONG-PAD = drill 1.016 long: 1 -6.35,0; 2 -3.81,0; 3 -1.27,0; 4 1.27,0; 5 3.81,0; 6 6.35,0

### Placement (x,y rotation side)
C1  167.64,71.44 270 top
C2  163.67,71.44 270 top
C3  105.41,34.13 180 top
C4  105.41,36.99 180 top
C5  24.13,99.38 0 top
C6  24.13,96.84 0 top
C7  48.58,109.86 90 top
C8  48.58,104.78 90 top
C9  24.13,101.92 0 top
C10  130.49,82.23 270 top
C11  133.03,82.23 270 top
C12  82.55,30.48 270 top
C13  104.14,30.48 90 top
C14  85.09,30.48 270 top
C15  13.02,21.59 90 top
C16  13.02,16.51 270 top
C17  13.65,62.23 90 top
C18  13.65,57.15 270 top
C19  172.09,21.59 90 top
C20  172.09,16.51 270 top
C21  172.09,62.23 90 top
C22  172.09,57.15 270 top
C23  30.48,43.18 90 top
C24  154.62,20.32 270 top
C25  29.53,81.92 180 top
C26  80.01,30.48 270 top
C28  46.67,118.11 0 top
C29  40.64,118.11 180 top
D1  20.32,114.94 270 top
D2  30.48,114.94 90 top
D3  22.86,112.39 270 top
D4  33.02,112.39 90 top
D5  25.4,109.86 270 top
D6  35.56,109.86 90 top
D7  40.64,113.67 180 top
ENKODER_A  7.94,57.15 270 top
ENKODER_B  7.94,16.51 270 top
ENKODER_C  177.48,16.51 90 top
ENKODER_D  177.48,57.15 90 top
GPIO1  65.41,85.72 90 top
H1  8.26,116.2 0 top
H2  8.26,27.94 0 top
H3  177.16,116.2 270 top
H4  177.16,27.94 0 top
IC1  92.71,30.48 90 top
IC2  41.91,102.23 270 top
IC3  41.91,79.38 270 top
IC4  136.84,73.66 0 top
IC6  27.94,30.48 180 top
IC8  157.16,33.02 0 top
J1  166.37,86.36 0 top
LED1  101.6,46.99 180 top
LED3  119.38,83.19 180 top
MMS1  144.78,36.83 270 top
MMS2  40.64,36.83 90 top
Q1  100.33,35.56 270 top
R1  92.71,30.48 90 top
R2  65.41,97.16 180 top
R3  81.28,97.16 0 top
R4  65.41,92.08 180 top
R5  81.28,92.08 0 top
R6  83.82,64.14 180 top
R7  101.6,64.14 0 top
R8  83.82,69.22 180 top
R9  101.6,69.22 0 top
R10  83.82,74.3 180 top
R11  101.6,74.3 0 top
R12  121.92,22.86 270 top
R13  124.46,22.86 270 top
R14  127,22.86 270 top
R15  52.7,95.89 0 top
R16  52.7,93.34 0 top
R17  27.94,107.31 90 top
R18  27.94,98.11 90 top
R19  32.07,74.3 0 top
R20  32.07,71.75 180 top
R21  30.48,104.78 90 top
R22  30.48,95.57 90 top
R23  32.07,79.38 0 top
R24  32.07,76.83 180 top
R25  33.34,102.23 90 top
R26  33.34,93.03 90 top
R27  32.07,84.45 0 top
R28  32.07,87 180 top
R29  93.66,91.44 90 top
R30  91.44,91.44 90 top
R31  143.19,83.82 270 top
R32  124.78,92.08 180 top
R33  140.65,92.08 0 top
R34  124.78,97.16 180 top
R35  140.65,97.16 0 top
R36  145.73,83.82 270 top
R37  27.3,118.11 90 top
R38  35.56,120.02 270 top
R39  99.38,97.16 180 top
R40  115.25,97.16 0 top
R41  99.38,92.08 180 top
R42  115.25,92.08 0 top
R43  25.4,20.32 270 top
R44  27.94,20.32 90 top
R45  33.02,20.32 270 top
R46  22.86,20.32 270 top
R47  20.32,20.32 90 top
R48  35.56,20.32 270 top
R49  20.32,40.64 90 top
R50  22.86,40.64 270 top
R51  35.56,40.64 90 top
R52  27.94,40.64 90 top
R53  25.4,40.64 270 top
R54  33.02,40.64 90 top
R55  159.7,22.86 270 top
R56  157.16,22.86 90 top
R57  152.08,22.86 270 top
R58  162.24,22.86 270 top
R59  164.78,22.86 90 top
R60  149.54,22.86 270 top
R61  164.78,43.18 90 top
R62  162.24,43.18 270 top
R63  149.54,43.18 90 top
R64  157.16,43.18 90 top
R65  159.7,43.18 270 top
R66  152.08,43.18 90 top
R67  129.54,22.86 270 top
R68  62.55,78.11 90 top
R69  132.08,22.86 270 top
R70  111.76,58.42 180 top
R71  134.62,22.86 270 top
R72  52.7,98.42 0 top
R73  124.46,85.09 90 top
R74  49.53,113.67 0 top
R75  89.22,91.44 90 top
R76  87,91.44 90 top
R77  151.76,59.37 270 top
R78  124.78,102.23 0 top
R79  124.78,99.69 0 top
R80  148.27,83.82 270 top
R81  145.73,49.53 0 top
R82  145.73,52.07 0 top
R83  145.73,54.61 0 top
R84  154.31,59.37 90 top
R85  156.84,59.37 90 top
R86  159.38,59.37 90 top
R87  160.97,73.66 90 top
R88  158.43,73.66 90 top
R89  155.89,73.66 90 top
R90  16.19,53.34 180 top
R91  163.83,78.74 90 top
R92  54.61,111.12 0 top
R93  54.61,108.58 0 top
R94  166.37,78.74 90 top
R95  168.91,78.74 90 top
R96  33.02,8.26 90 top
R97  25.4,8.26 90 top
R98  163.83,8.26 90 top
R99  161.29,8.26 90 top
R100  20.32,60.96 0 top
R101  77.47,29.21 270 top
R102  105.73,50.8 90 top
R103  19.05,50.8 0 top
R104  19.05,48.26 0 top
R105  19.05,45.72 0 top
R106  32.07,69.22 0 top
R107  161.93,59.37 90 top
R108  124.78,104.78 0 top
R109  17.78,16.51 270 top
R110  20.32,58.42 0 top
R111  20.32,55.88 0 top
R112  169.54,16.51 270 top
R113  167,16.51 270 top
R114  169.54,59.69 90 top
R115  167,59.69 90 top
R117  15.24,16.51 270 top
SERVO  86.68,105.09 0 top
SV1  80.01,39.37 0 top
SW2  92.71,54.61 180 top
TX  73.34,97.16 180 top
TX1  132.72,92.08 180 top
TX2  132.72,97.16 180 top
TX3  107.31,97.16 180 top
TX4  107.31,92.08 180 top
TX5  73.34,92.08 180 top
TX6  92.71,64.14 180 top
TX7  92.71,69.22 180 top
TX8  92.71,74.3 180 top
U$1  149.86,122.24 270 top
U$2  VOLTOMIERZ  [VOLTOMIERZ]  121.6,107.95 0 top
UART_A  102.87,17.78 90 top
UART_R  69.22,105.09 0 top
X1  180.34,92.71 270 top
X2  13.02,74.3 180 top
X3  13.02,81.92 180 top
X10  10.48,92.08 180 top
X11  107.63,105.09 0 top
X12  180.34,105.41 270 top

### Tracks (layer width: path | path; a pad name or v marks a point on that pad's centre or on a via)
3V3_ECHO_1
  Bottom 0.813: GPIO1.26 100.33,87.63 100.33,94.3 R39.1 TX3.3
3V3_ECHO_2
  Bottom 0.813: TX4.3 R41.1 103.19,87.95 GPIO1.28
3V3_MISO
  Bottom 0.813: TX7.3 R8.1 86.36,69.22 85.09,70.48 85.09,74.93 GPIO1.21
3V3_MOSI
  Bottom 0.813: TX6.3 R6.1 83.19,64.14 82.55,64.77 82.55,74.93 GPIO1.19
3V3_SCK
  Bottom 0.813: 88.9,74.3 TX8.3 90.55,74.68 | 88.9,74.3 R10.1 | GPIO1.23 88.9,76.2 88.9,74.3
5V_MISO
  Bottom 0.813: TX7.1 R9.1 99.06,69.22 100.33,67.94 100.33,62.87 99.38,61.91 95.57,61.91 92.71,59.05 SW2.2
5V_MOSI
  Bottom 0.813: R7.1 TX6.1 90.17,59.44 SW2.3
5V_SCK
  Bottom 0.813: TX8.1 R11.1 100.33,74.3 102.87,71.75 102.87,61.59 100.97,59.69 96.52,59.69 SW2.1
+3V3  (7 unrouted)
  Top 0.813: 79.38,74.3 80.01,73.66
  Bottom 0.813: TX8.2 TX7.2 TX6.2 90.17,61.59 81.28,61.59 80.01,62.87 R6.2 R10.2 | GPIO1.1 64.14,81.92 62.55,83.5 | 61.59,95.89 R2.2 61.59,98.11 61.91,98.42 | 61.59,93.34 61.59,95.89 | 61.59,93.34 R4.2 61.59,84.45 62.55,83.5 | C7.2 IC2.16 R74.1 45.72,117.79 C28.+ 45.4,120.97 44.45,121.92 R37.2 | 25.4,116.05 D5.C 26.67,113.67 R37.1 | D3.C 25.24,116.2 25.4,116.05 | D1.C 24.77,118.75 25.4,118.11 25.4,116.05 | C25.1 35.56,81.92 IC3.4 | 80.01,74.61 R10.2 | R10.2 80.01,74.93 GPIO1.17 | R15.2 61.59,95.89 | R16.2 61.59,93.34 | TX2.2 TX1.2 132.72,90.81 130.81,88.9 R73.2 121.28,88.9 | 121.28,88.9 107.95,88.9 107.31,89.53 TX4.2 TX3.2 107.31,98.42 106.68,99.06 96.52,99.06 95.57,98.11 R39.2 R41.2 95.57,90.49 94.61,89.53 75.56,89.53 73.34,91.76 TX5.2 TX.2 71.44,99.06 62.55,99.06 61.91,98.42 | R34.2 R32.2 | R32.2 121.28,92.08 | R68.2 62.55,83.5 | 62.55,73.98 R68.1 62.55,71.75 61.28,70.48 50.16,70.48 44.45,64.77 43.18,64.77 41.91,63.5 35.56,63.5 33.02,66.04 33.02,78.74 35.56,81.28 | R72.2 61.91,98.42 | R72.1 53.34,102.87 R74.2 | R32.2 120.97,89.22 121.28,88.9 | R8.2 R10.2
A1
  Bottom 0.813: R51.1 IC6.1 35.56,33.02 44.45,24.13 IC1.24
A2
  Bottom 0.813: IC1.25 44.45,21.59 33.02,33.02 IC6.2 R54.1
AGND  (1 unrouted)
  Bottom 0.813: C8.1 IC2.13 42.55,103.5 40.64,105.41 | 39.37,113.03 C29.- 37.47,116.2 R38.2 35.56,115.57 | 39.37,113.03 40.64,111.76 40.64,105.41 | D6.A 38.73,113.67 39.37,113.03 | D6.A 33.66,113.67 33.02,114.3 | 33.02,114.3 30.48,114.3 30.48,118.11 | 33.02,115.57 D4.A 34.92,116.2 35.56,115.57 | 33.02,115.57 33.02,114.3 | 35.56,115.57 D6.A | IC2.4 38.73,103.5 40.64,105.41 | C9.1 C6.1 28.26,91.44 R28.2 28.89,86.36 29.21,86.36 29.69,85.88 29.69,83.34 | IC3.10 IC3.11 | 30.48,76.2 30.48,73.66 28.57,71.75 R20.2 28.26,71.44 26.67,69.85 9.84,69.85 7.94,71.75 7.94,73.66 | R24.2 29.84,76.83 30.48,76.2 | 30.48,76.2 30.48,80.01 28.57,81.92 C25.2 29.69,83.34 | 29.69,83.34 29.84,83.5 | C9.1 22.54,101.92 | 30.48,118.11 29.21,118.11 25.4,121.92 11.43,121.92 11.43,120.65 13.97,118.11 13.97,114.3 7.94,108.27 7.94,102.23 | D2.A 30.48,118.11 | 30.48,118.11 33.02,115.57 | C5.1 C9.1 | 7.94,81.28 X2.5 | 7.94,91.44 X3.5 | 7.94,102.23 X10.3 | C9.1 8.26,101.92 7.94,102.23
  Bottom 1.27: X2.5 7.94,73.66 | X3.5 7.94,81.28 | X10.3 7.94,91.44
  pour Bottom (isolate 0.61): 1.27,67.31 1.27,125.73 33.02,125.73 33.02,119.38 46.35,119.38 46.35,116.52 46.99,115.89 46.99,106.68 48.26,106.68 49.53,105.41 49.53,104.14 48.26,102.87 35.56,102.87 35.56,90.17 53.34,90.17 59.69,83.82 59.69,67.31
AKU_1
  Bottom 0.813: R19.1 X2.1
  Bottom 1.27: X2.1 18.1,73.66
AKU_2
  Bottom 0.813: X3.1 19.68,81.92 22.23,79.38 R23.1
  Bottom 1.27: X3.1 18.1,81.28
AKU_3
  Bottom 0.813: R27.1 23.5,84.45 15.88,92.08 X10.1
  Bottom 1.27: X10.1 13.02,91.44
B1
  Bottom 0.813: IC6.13 R45.1 33.02,21.59 38.1,16.51 IC1.27
B2
  Bottom 0.813: IC6.14 R48.1 35.56,21.59 38.1,19.05 IC1.26
C1
  Bottom 0.813: IC1.28 88.9,12.7 90.17,11.43 105.41,11.43 106.68,12.7 106.68,17.78 107.95,19.05 146.05,19.05 152.08,25.08 R57.1 IC8.2
C2
  Bottom 0.813: IC8.1 R60.1 149.54,26.35 144.78,21.59 IC1.4
D1  (1 unrouted)
  Bottom 0.813: IC1.6 139.7,26.67 149.54,36.51 | IC8.14 R63.1
D2
  Bottom 0.813: IC1.5 140.97,24.13 152.08,35.24 IC8.13 R66.1
E1_0
  Bottom 0.813: GPIO1.31 104.78,80.64 107.95,77.47 107.95,46.99 R14.1
E1_1
  Bottom 0.813: GPIO1.33 107.31,80.64 110.49,77.47 110.49,46.99 R67.1
E1_2
  Bottom 0.813: GPIO1.35 109.86,80.64 113.03,77.47 113.03,46.99 R69.1
E1_3
  Bottom 0.813: GPIO1.37 112.39,80.64 115.57,77.47 115.57,46.99 R71.1
ECHO_1
  Bottom 0.813: R40.1 TX3.1 109.47,98.81 106.36,101.92 X11.3
  Bottom 1.27: X11.3 106.36,105.73
ECHO_2
  Bottom 0.813: TX4.1 R42.1 111.44,92.39 113.03,93.98 113.03,97.79 108.9,101.92 X11.4
  Bottom 1.27: X11.4 108.9,105.73
GND  (via drill 0.7)  (6 unrouted)
  Bottom 0.406: GPIO1.6 71.75,83.19 76.83,83.19 | 76.83,83.19 GPIO1.9 | 76.83,83.19 81.92,83.19 | 81.92,83.19 GPIO1.14 | 81.92,83.19 89.53,83.19 | 89.53,83.19 GPIO1.20 | 89.53,83.19 97.16,83.19 | 97.16,83.19 GPIO1.25 | 97.16,83.19 102.23,83.19 | 102.23,83.19 GPIO1.30 | 102.23,83.19 107.31,83.19 | 107.31,83.19 GPIO1.34 | 107.31,83.19 114.94,83.19 GPIO1.39
  Bottom 0.813: IC1.8 105.41,31.75 106.68,33.02 C4.1 | R38.1 45.4,123.83 47.94,121.28 C28.- 49.53,118.11 50.8,116.84 R93.1 50.8,106.68 | GPIO1.34 107.31,85.72 108.58,87 | 108.58,87 124.46,87 C10.1 C11.1 134.3,83.5 135.57,82.23 IC4.13 IC4.12 138.11,80.96 139.7,82.55 153.67,82.55 | GPIO1.30 104.78,87 108.58,87 | IC6.12 30.48,16.51 R44.1 25.4,19.05 22.86,19.05 R47.1 19.05,15.24 C16.2 10.16,15.24 | IC1.22 C12.2 81.28,29.21 C26.2 71.12,27.94 71.12,43.18 | SV1.10 SV1.8 81.28,41.91 81.28,43.18 71.12,43.18 | 50.8,106.68 50.8,102.87 48.9,100.97 IC2.12 42.55,100.97 40.64,99.06 40.64,95.25 38.73,93.34 IC2.8 IC2.7 IC2.6 IC2.5 | 50.8,106.68 49.53,107.95 49.21,107.95 C7.1 | 113.98,105.73 113.98,108.27 | 113.98,108.27 112.39,109.86 91.12,109.86 90.49,109.22 SERVO.4 | U$1.OUT- 151.43,69.85 IC4.8 IC4.7 IC4.6 | 140.65,68.26 IC4.6 | R53.1 R50.1 R105.2 | X11.6 113.98,103.19 114.94,102.23 R78.1 R108.1 | 133.35,102.23 144.15,102.23 153.67,92.71 153.67,82.55 | 133.35,102.23 R78.2 128.59,105.09 118.11,115.57 66.04,115.57 59.05,108.58 R93.2 R92.2 | 153.67,82.55 153.67,78.74 154.94,77.47 R89.2 157.48,77.47 R88.2 R87.2 170.18,77.47 180.34,67.31 180.34,63.5 | 158.75,70.17 151.75,70.17 U$1.OUT- | 158.75,70.17 C2.2 161.6,70.17 C1.- | C13.2 v115.57,31.75 | ENKODER_D.2 C22.2 C19.2 180.34,22.86 180.34,15.24 | U$1.OUT- 151.76,70.06 R77.1 R85.2 R86.2 | R62.1 R65.1 159.7,47.62 154.62,52.7 | R83.1 R81.1 141.92,36.51 137.16,31.75 v133.35,31.75 | R77.2 150.81,54.61 R83.2 R82.2 R81.2 | 154.62,52.7 R77.2 | R77.2 R86.1 | R89.1 156.21,69.85 | R88.1 158.75,69.85 158.75,70.17 | R87.1 161.29,69.85 | 163.83,16.51 165.1,17.78 165.1,18.73 R59.1
  Bottom 0.813: 163.83,16.51 167.64,16.51 168.91,15.24 C20.2 ENKODER_C.2 180.34,15.24 | 43.81,6.35 46.35,6.35 | 43.81,6.35 30.48,6.35 10.16,6.35 5.08,11.43 5.08,13.97 6.35,15.24 5.08,16.51 5.08,21.59 6.35,22.86 C15.2 13.97,23.81 R105.1 R104.1 | 46.35,10.79 46.35,6.35 | 43.81,10.48 43.81,6.35 | 46.35,6.35 154.94,6.35 155.57,6.99 155.57,9.53 | 177.8,6.35 180.34,8.89 180.34,15.24 | 180.34,63.5 180.34,55.88 178.12,55.88 | R100.1 15.24,62.23 15.24,63.5 | 12.7,63.5 6.35,63.5 5.08,62.23 5.08,57.15 6.35,55.88 | 29.84,63.5 29.84,64.14 29.21,64.77 25.4,64.77 24.13,63.5 R100.2 | 155.57,9.53 MMS1.22 | 155.57,9.53 156.21,8.89 | 163.83,16.51 160.02,16.51 158.75,17.78 158.43,17.78 R56.1 C24.2 | MMS1.5 MMS1.4 140.65,61.91 IC4.6 | R103.1 13.65,50.8 C18.2 10.16,55.88 | R105.2 R53.1 | R53.1 25.4,45.72 26.67,46.99 29.21,46.99 | 29.21,46.99 30.48,45.72 C23.2 | J1.1 166.37,93.98 166.34,94 166.34,95.22 | 113.98,108.27 115.57,106.68 119.38,106.68 120.65,105.41 | R108.2 129.22,104.14 132.08,104.14 133.35,102.87 133.35,102.23 | R105.2 R104.2 R103.2 | C21.2 180.34,63.5 | IC8.12 154.62,52.7 | 71.12,43.18 48.26,43.18 44.45,46.99 29.21,46.99
  Bottom 1.016: 30.48,16.51 30.48,6.35 | MMS1.5 139.06,60.33 | MMS1.4 141.6,60.33 | ENKODER_D.2 178.12,55.88 | MMS1.22 155.57,13.34 | 29.84,59.37 29.84,58.74 | 29.84,63.5 29.84,62.87
  Bottom 1.27: 29.84,62.87 MMS2.22 29.84,59.37 | 43.81,14.29 MMS2.4 43.81,10.48 | 46.35,13.97 MMS2.5 46.35,10.79 | 6.35,15.24 ENKODER_B.3 10.16,15.24 | 6.35,55.88 ENKODER_A.3 10.16,55.88 | 12.7,63.5 C17.2 15.24,63.5 | SERVO.4 90.49,104.46 | X11.6 113.98,105.73
  Bottom 2.54: X1.1 166.34,95.22 157.48,86.36 157.48,77.47
  pour Bottom (isolate 0.61, rank 4): 1.27,125.73 184.15,125.73 184.15,1.27 1.27,1.27
I_CS1
  Bottom 0.813: IC4.2 126.36,65.72 MMS1.9
I_CS2
  Bottom 0.813: IC4.1 123.83,65.72 MMS1.10
I_D4
  Bottom 0.813: R14.2 127,16.51 128.91,14.61 MMS1.16
  Bottom 1.016: MMS1.16 128.91,12.06
I_D7
  Bottom 0.813: R67.2 129.54,16.51 130.81,15.24 134.62,15.24 136.53,13.34 MMS1.13
  Bottom 1.016: MMS1.13 136.53,12.06
I_D8
  Bottom 0.813: R69.2 132.08,16.51 135.89,16.51 139.7,12.7 MMS1.28
  Bottom 1.016: MMS1.28 140.34,12.06
I_D9
  Bottom 0.813: R71.2 137.16,17.78 139.7,15.24 140.97,15.24 142.88,13.34 MMS1.27
  Bottom 1.016: MMS1.27 142.88,12.06
II_CS1  (1 unrouted)
  Bottom 0.813: 133.35,69.85 IC4.3
II_CS2  (1 unrouted)
II_D4
  Bottom 0.813: MMS2.16 56.52,61.59 58.42,63.5 66.04,63.5 GPIO1.15
  Bottom 1.27: MMS2.16 56.52,60.33
II_D7
  Bottom 0.813: GPIO1.13 64.77,64.77 52.07,64.77 48.9,61.59 MMS2.13
  Bottom 1.27: MMS2.13 48.9,60.33
II_D8
  Bottom 0.813: GPIO1.11 63.5,66.04 50.8,66.04 46.99,62.23 45.72,62.23 45.09,61.59 MMS2.28
  Bottom 1.27: MMS2.28 45.09,60.33
II_D9
  Bottom 0.813: GPIO1.7 74.3,79.38 62.23,67.31 49.53,67.31 45.72,63.5 44.45,63.5 42.55,61.59 MMS2.27
  Bottom 1.27: MMS2.27 42.55,60.33
MISO
  Bottom 0.61: SV1.9 87.63,38.1 IC1.18
  Bottom 0.813: IC1.18 91.44,39.37 92.71,40.64 SW2.5
MOSI
  Bottom 0.61: SV1.1 76.2,39.37 86.36,39.37 IC1.17
  Bottom 0.813: IC1.17 90.17,41.91 91.44,43.18 91.44,48.26 90.17,49.53 SW2.4
MOSI1
  Bottom 0.813: TX1.1 R33.1 137.79,92.08 139.7,90.17 139.7,86.36 140.97,85.09 143.51,85.09 145.73,87.31 R36.1
MOSI2
  Bottom 0.813: TX5.1 R5.1 | R5.1 77.47,92.39 | 70.48,104.46 70.48,103.5 71.75,102.23 75.25,102.23 79.06,98.42 79.06,93.03 78.11,92.08 R5.1
  Bottom 1.27: UART_R.2 70.48,104.46
MOSI3
  Bottom 0.813: R3.1 TX.1 75.5,97.22 72.39,100.33 69.85,100.33 67.94,102.23 67.94,104.46
  Bottom 1.27: UART_R.1 67.94,104.46
MOSI4
  Bottom 0.813: TX2.1 R35.1 140.34,97.16 141.92,95.57 141.92,88.9 R31.1
N$1
  Bottom 0.813: C15.1 ENKODER_B.1 | C15.1 13.97,20.32 | IC6.11 27.94,29.21 26.67,30.48 17.78,30.48 16.51,29.21 16.51,21.59 R117.1 C15.1
  Bottom 1.27: ENKODER_B.1 7.3,20.32
N$2
  Bottom 0.813: IC1.10 99.19,36.83 | 99.19,36.83 Q1.1 | C4.2 103.98,36.83 99.19,36.83
N$3
  Bottom 0.813: R13.2 124.46,16.51 123.19,15.24 118.11,15.24 116.2,13.34 116.2,11.43 117.47,10.16 130.81,10.16 131.44,10.79 MMS1.15
  Bottom 1.016: MMS1.15 131.44,13.34
N$4
  Bottom 0.813: MMS1.14 133.99,9.53 133.03,8.57 117.16,8.57 114.3,11.43 114.3,13.97 117.79,17.46 121.6,17.46 R12.2
  Bottom 1.016: MMS1.14 133.99,13.34
N$5
  Bottom 0.813: GPIO1.24 94.61,86.68 R29.1
N$6
  Bottom 0.813: GPIO1.22 92.08,87 R30.1
N$7
  Bottom 0.813: C16.1 ENKODER_B.2 | C16.1 13.97,17.78 | IC6.9 22.86,27.94 21.59,29.21 19.05,29.21 18.41,28.57 18.41,20.95 17.14,19.68 | C16.1 15.24,17.78 17.14,19.68 | R109.1 17.14,19.68
  Bottom 1.27: ENKODER_B.2 7.3,17.78
N$8
  Bottom 0.813: IC6.10 R43.1 R44.2
N$9
  Bottom 0.813: IC4.9 R36.2
N$10
  Bottom 0.813: IC6.8 R47.2 R46.1
N$11
  Bottom 0.813: IC3.8 IC3.9
N$12
  Bottom 0.813: IC6.7 19.05,34.29 18.41,34.92 18.41,56.52 17.78,57.15 | 17.78,57.15 13.97,60.96 C17.1 ENKODER_A.1 | R110.1 17.78,57.15
  Bottom 1.27: ENKODER_A.1 7.3,60.96
N$13
  Bottom 0.813: ENKODER_C.4 C19.1 R112.1 168.91,20.95 168.91,30.48 167.64,31.75 161.29,31.75 159.7,30.16 IC8.5
N$14
  Bottom 0.813: R55.1 R56.2 IC8.4
N$15
  Bottom 0.813: 71.18,91.69 TX5.3 R4.1 67.31,92.08 66.04,90.81 66.04,88.9 66.67,88.27 73.03,88.27 GPIO1.10
N$16
  Bottom 0.813: TX.3 R2.1 | R2.1 69.22,97.47 | GPIO1.8 72.39,86.36 66.04,86.36 63.5,88.9 63.5,96.2 64.45,97.16 R2.1
N$17
  Bottom 0.813: C8.2 IC2.14 43.5,106.05 43.18,106.36 D7.C 41.91,114.94 C29.+
N$18
  Bottom 0.813: C14.1 IC1.21
N$19
  Bottom 0.813: GPIO1.40 116.2,84.45 117.47,83.19 LED3.K
N$20
  Bottom 0.813: IC4.10 R31.2
N$21
  Bottom 2.54: U$1.IN+ 168.64,120.38 167.64,119.38 167.64,109.22 168.91,107.95 180.31,107.95 X12.1
N$22
  Bottom 0.813: IC1.3 UART_A.2
N$23
  Bottom 2.54: X12.2 165.68,102.92 151.76,116.84 151.76,120.32 U$1.IN-
N$24
  Bottom 0.813: IC6.6 R50.2 R49.1
N$25
  Bottom 0.813: IC6.4 R52.1 R53.2
N$26
  Bottom 0.813: R75.1 89.22,86.68 GPIO1.18
N$27
  Bottom 0.813: ENKODER_A.2 C18.1 13.97,58.42 R111.1 16.51,33.02 17.78,31.75 24.13,31.75 25.4,33.02 IC6.5
  Bottom 1.27: ENKODER_A.2 7.3,58.42
N$28
  Bottom 0.813: R76.1 87,87 GPIO1.16
N$29
  Bottom 0.813: IC1.2 UART_A.1
N$30
  Bottom 0.813: R59.2 R58.1 IC8.6
N$31
  Bottom 0.813: R23.2 R24.1 IC3.5
N$32
  Bottom 0.813: R75.2 89.22,100.01 85.41,103.82 SERVO.2
  Bottom 1.27: SERVO.2 85.41,105.73
N$33
  Bottom 0.813: R28.1 R27.2 35.88,83.5 37.47,81.92 IC3.3
N$34
  Bottom 0.813: R19.2 R20.1 35.88,70.8 38.1,69.85 41.91,69.85 43.18,71.12 43.18,81.28 43.81,81.92 IC3.12
N$35
  Bottom 0.813: IC1.9 99.19,34.29 | 99.19,34.29 Q1.2 | 99.19,34.29 104.14,34.29 C3.2
N$36
  Bottom 0.813: R76.2 87,99.69 82.87,103.82 SERVO.1
  Bottom 1.27: SERVO.1 82.87,105.73
N$37
  Bottom 0.813: LED1.A R102.1
N$38
  Bottom 0.813: IC1.14 LED1.K
N$39
  Bottom 0.61: R101.1 77.47,35.56 SV1.5
N$40  (1 unrouted)
  Bottom 0.813: D2.C IC2.1 D1.A
N$41
  Bottom 0.813: R17.1 R18.2 C9.2
N$43
  Bottom 0.813: D4.C IC2.2 | D4.C D3.A | R21.2 D4.C
N$45
  Bottom 0.813: IC2.3 D6.C | D6.C D5.A | R25.2 D6.C
N$47
  Bottom 0.813: R21.1 R22.2 C5.2
N$51
  Bottom 0.813: IC4.14 C11.2
N$52
  Bottom 0.813: R25.1 R26.2 C6.2
N$58
  Bottom 0.813: LED3.A 120.65,82.55 121.92,81.28 R73.1
N$60
  Bottom 0.813: IC3.13 IC3.14 45.09,87 40.64,91.44 36.83,91.44 33.97,94.3 R18.1
N$62
  Bottom 0.813: ENKODER_C.3 C20.1 168.91,17.78 167,19.68 | 165.1,29.21 IC8.7 166.37,29.21 167,28.57 167,19.68 | R113.1 167,19.68
N$65
  Bottom 0.813: R22.1 33.97,91.76 35.56,90.17 39.37,90.17 40.64,88.9 40.64,76.2 38.73,74.3 IC3.6 IC3.7
N$66  (1 unrouted)
  Bottom 0.813: ENKODER_D.4 C21.1 171.45,60.96 167,56.52 167,34.92 166.37,34.29 163.83,34.29 162.24,35.88 IC8.9
  Bottom 1.016: ENKODER_D.4 178.12,60.96
N$67
  Bottom 0.813: R62.2 R61.1 IC8.8
N$68
  Bottom 0.813: R64.1 R65.2 IC8.10
N$69
  Bottom 0.813: R26.1 33.66,88.9 36.83,88.9 38.1,87.63 IC3.1 IC3.2
N$70
  Bottom 0.813: ENKODER_D.3 C22.1 171.45,58.42 168.91,55.88 | IC8.11 157.16,34.61 158.75,33.02 167.64,33.02 168.91,34.29 168.91,55.88 | R114.1 168.91,55.88
  Bottom 1.016: ENKODER_D.3 178.12,58.42
PWM1
  Bottom 0.813: IC1.12 97.79,41.91 100.33,44.45 107.95,44.45 R13.1
PWM2
  Bottom 0.813: IC1.11 97.79,39.37 100.33,41.91 107.95,41.91 R12.1
PWM3
  Bottom 0.813: IC1.15 66.04,46.99 53.98,59.05 MMS2.15
  Bottom 1.27: MMS2.15 53.98,61.59
PWM4
  Bottom 0.813: IC1.16 66.04,44.45 51.44,59.05 MMS2.14
  Bottom 1.27: MMS2.14 51.44,61.59
RST
  Bottom 0.61: 92.71,25.4 R101.2
  Bottom 0.813: IC1.1 93.98,13.97 92.71,15.24 92.71,25.4 R1.1
SCK
  Bottom 0.61: SV1.7 83.82,36.83 IC1.19
  Bottom 0.813: IC1.19 92.71,36.83 93.98,38.1 93.98,48.26 95.25,49.53 SW2.6
SCL
  Bottom 0.813: GPIO1.5 66.04,76.2 59.69,76.2 43.18,92.71 43.18,95.25 43.81,95.89 IC2.10 R15.1 66.67,113.67 117.47,113.67 125.73,105.41 125.73,97.79 126.36,97.16 R34.1 TX2.3
SDA
  Bottom 0.813: GPIO1.3 66.04,78.74 60.96,78.74 46.35,93.34 IC2.9 R16.1 67.31,111.76 116.84,111.76 123.19,105.41 123.19,93.98 125.09,92.08 R32.1 TX1.3
TRIG_1
  Bottom 0.813: X11.1 101.28,103.19 100.97,102.87 95.25,102.87 91.44,99.06 R30.2
  Bottom 1.27: X11.1 101.28,105.73
TRIG_2
  Bottom 0.813: X11.2 103.82,101.92 102.87,100.97 95.89,100.97 93.66,98.74 R29.2
  Bottom 1.27: X11.2 103.82,105.73
VCC  (via drill 0.7)  (13 unrouted)
  Bottom 0.813: R5.2 R3.2 85.09,99.06 81.28,102.87 81.28,106.68 82.55,107.95 86.36,107.95 87.95,106.36 87.95,105.73 | R42.2 R40.2 119.06,99.38 118.75,99.69 | 138.11,72.71 137.16,73.66 | R79.1 118.75,99.69 | 118.75,99.69 118.11,100.33 113.03,100.33 111.44,101.92 X11.5 | R79.2 141.92,99.69 R35.2 R33.2 144.46,91.76 148.27,87.95 R80.1 | 160.29,58.42 160.29,58.37 | R11.2 R9.2 R7.2 105.41,59.69 R70.2 105.73,57.47 R102.2 | 164.78,46.67 R61.2 | 164.78,62.55 164.6,62.73 | R91.1 163.67,74.77 | R117.2 13.97,12.7 | R109.2 19.05,12.7 | R90.2 ENKODER_A.4 | 111.44,105.41 111.44,105.73 109.22,107.95 97.79,107.95 91.44,101.6 90.17,101.6 87.95,103.82 SERVO.3 | 27.3,42.55 26.67,41.91 | 20,60.33 20.32,60.01
  Bottom 1.016: 167.64,82.55 R95.2 | R96.2 33.02,11.43 | MMS2.3 41.27,12.06 | R99.2 161.29,12.7 | R99.1 161.29,1.73 | R98.1 163.83,2.54 | R97.1 25.4,1.73 | R96.1 33.02,1.73
  Bottom 1.27: 159.7,21.59 160.97,21.59 162.24,20.32 R58.2 | R55.2 159.7,21.59 | R48.2 R45.2 R96.2 | C12.1 82.55,33.02 | 82.55,33.02 83.82,34.29 IC1.20 R1.2 92.71,30.48 93.98,29.21 IC1.7 C13.1 v118.11,29.21 | 152.4,73.66 137.16,73.66 129.54,73.66 127.95,75.25 IC4.16 127.95,79.69 129.22,80.96 C10.2 | IC4.5 138.11,72.71 | R80.2 148.27,77.79 152.4,73.66 | 144.15,58.42 R70.1 | 146.05,58.42 144.15,58.42 | 146.05,58.42 160.29,58.42 164.6,62.73 165.87,64 | 165.87,64 U$1.OUT+ 171.99,71.85 170.18,73.66 167.64,73.66 | MMS1.3 144.15,58.42 | v135.89,29.21 139.7,29.21 146.05,35.56 146.05,46.99 | 146.05,46.99 146.05,58.42 | R66.2 R63.2 146.05,46.99 | R64.2 157.16,46.04 158.75,44.45 162.56,44.45 164.78,46.67 | R61.2 164.78,62.55 | ENKODER_B.4 13.97,12.7 19.05,12.7 24.13,12.7 25.4,11.43 | 33.02,11.43 34.29,10.16 39.37,10.16 41.27,12.06 | R99.2 R98.2 167,12.06 | 161.29,12.7 158.75,15.24 151.13,15.24 149.54,16.83 R60.2 R57.2 C24.1 | R90.1 20.32,53.34 R49.2 20.32,43.18 21.59,41.91 26.67,41.91 C23.1 | 27.3,42.55 27.94,43.18 R52.2 | R51.2 R54.2 33.02,43.18 31.75,41.91 C23.1 | R97.2 R43.2 R46.2 | 182.88,53.34 ENKODER_D.1 183.51,53.34 | 152.4,73.66 162.56,73.66 | 162.56,73.66 R91.1 | 163.67,73.66 162.56,73.66 | 163.67,73.66 165.1,73.66 | R94.1 165.1,73.66 | 167.64,73.66 165.1,73.66 | 167.64,73.66 R95.1 | C2.1 163.67,73.66 | 167.64,73.66 C1.+ | R110.2 20.32,58.42 | R111.2 20.32,55.88 | 82.55,33.02 C26.1 | IC6.3 C23.1 | 165.87,64 166.5,64 R115.2 R114.2 | IC8.3 C24.1 | C24.1 159.7,21.59 | 169.54,12.06 167,12.06 | 169.54,12.06 176.85,12.06 ENKODER_C.1 | R112.2 169.54,12.06 | R113.2 167,12.06 | 20.32,60.01 20.32,60.96 15.24,66.04 | ENKODER_A.4 7.62,53.34 | SERVO.3 87.95,105.73
  Bottom 1.27: X11.5 111.44,105.41
  Bottom 1.422: R91.2 167.64,82.55
  Bottom 1.524: 15.24,66.04 3.81,66.04 1.91,64.14 1.91,3.17 3.35,1.73 25.4,1.73 33.02,1.73 161.29,1.73 180.8,1.73 183.51,4.45 183.51,53.34 183.51,73.98 174.94,82.55 R95.2 | 20.32,53.34 20.32,55.88 20.32,58.42 20.32,60.01
  Bottom 2.54: X1.2 171.5,90.22 168.91,87.63 R95.2
WYPELNIENIE
  Bottom 0.813: 57.15,58.42 68.58,58.42 68.58,63.5 77.47,72.39 78.11,71.75 78.11,61.59 80.01,59.69 87.63,59.69 87.63,57.15 88.9,55.88 102.87,55.88 104.14,54.61 104.14,50.8 102.87,49.53 97.79,49.53 97.79,52.07 96.52,53.34 88.9,53.34 87.63,52.07 87.63,49.53 87,48.9 66.67,48.9 57.15,58.42
  pour Bottom (isolate 0.61): 58.42,58.42 68.58,58.42 68.58,63.5 77.47,72.39 78.11,71.75 78.11,61.59 78.74,60.96 80.01,59.69 87.63,59.69 87.63,57.15 88.9,55.88 102.87,55.88 104.14,54.61 104.14,52.07 104.14,50.8 102.87,49.53 97.79,49.53 97.79,52.07 96.52,53.34 88.9,53.34 87.63,52.07 87.63,49.53 87,48.9 66.67,48.9 58.42,57.15 57.15,58.42